# Altium project Carrier-Board-Apalis.PrjPcb (part 1 of 2)
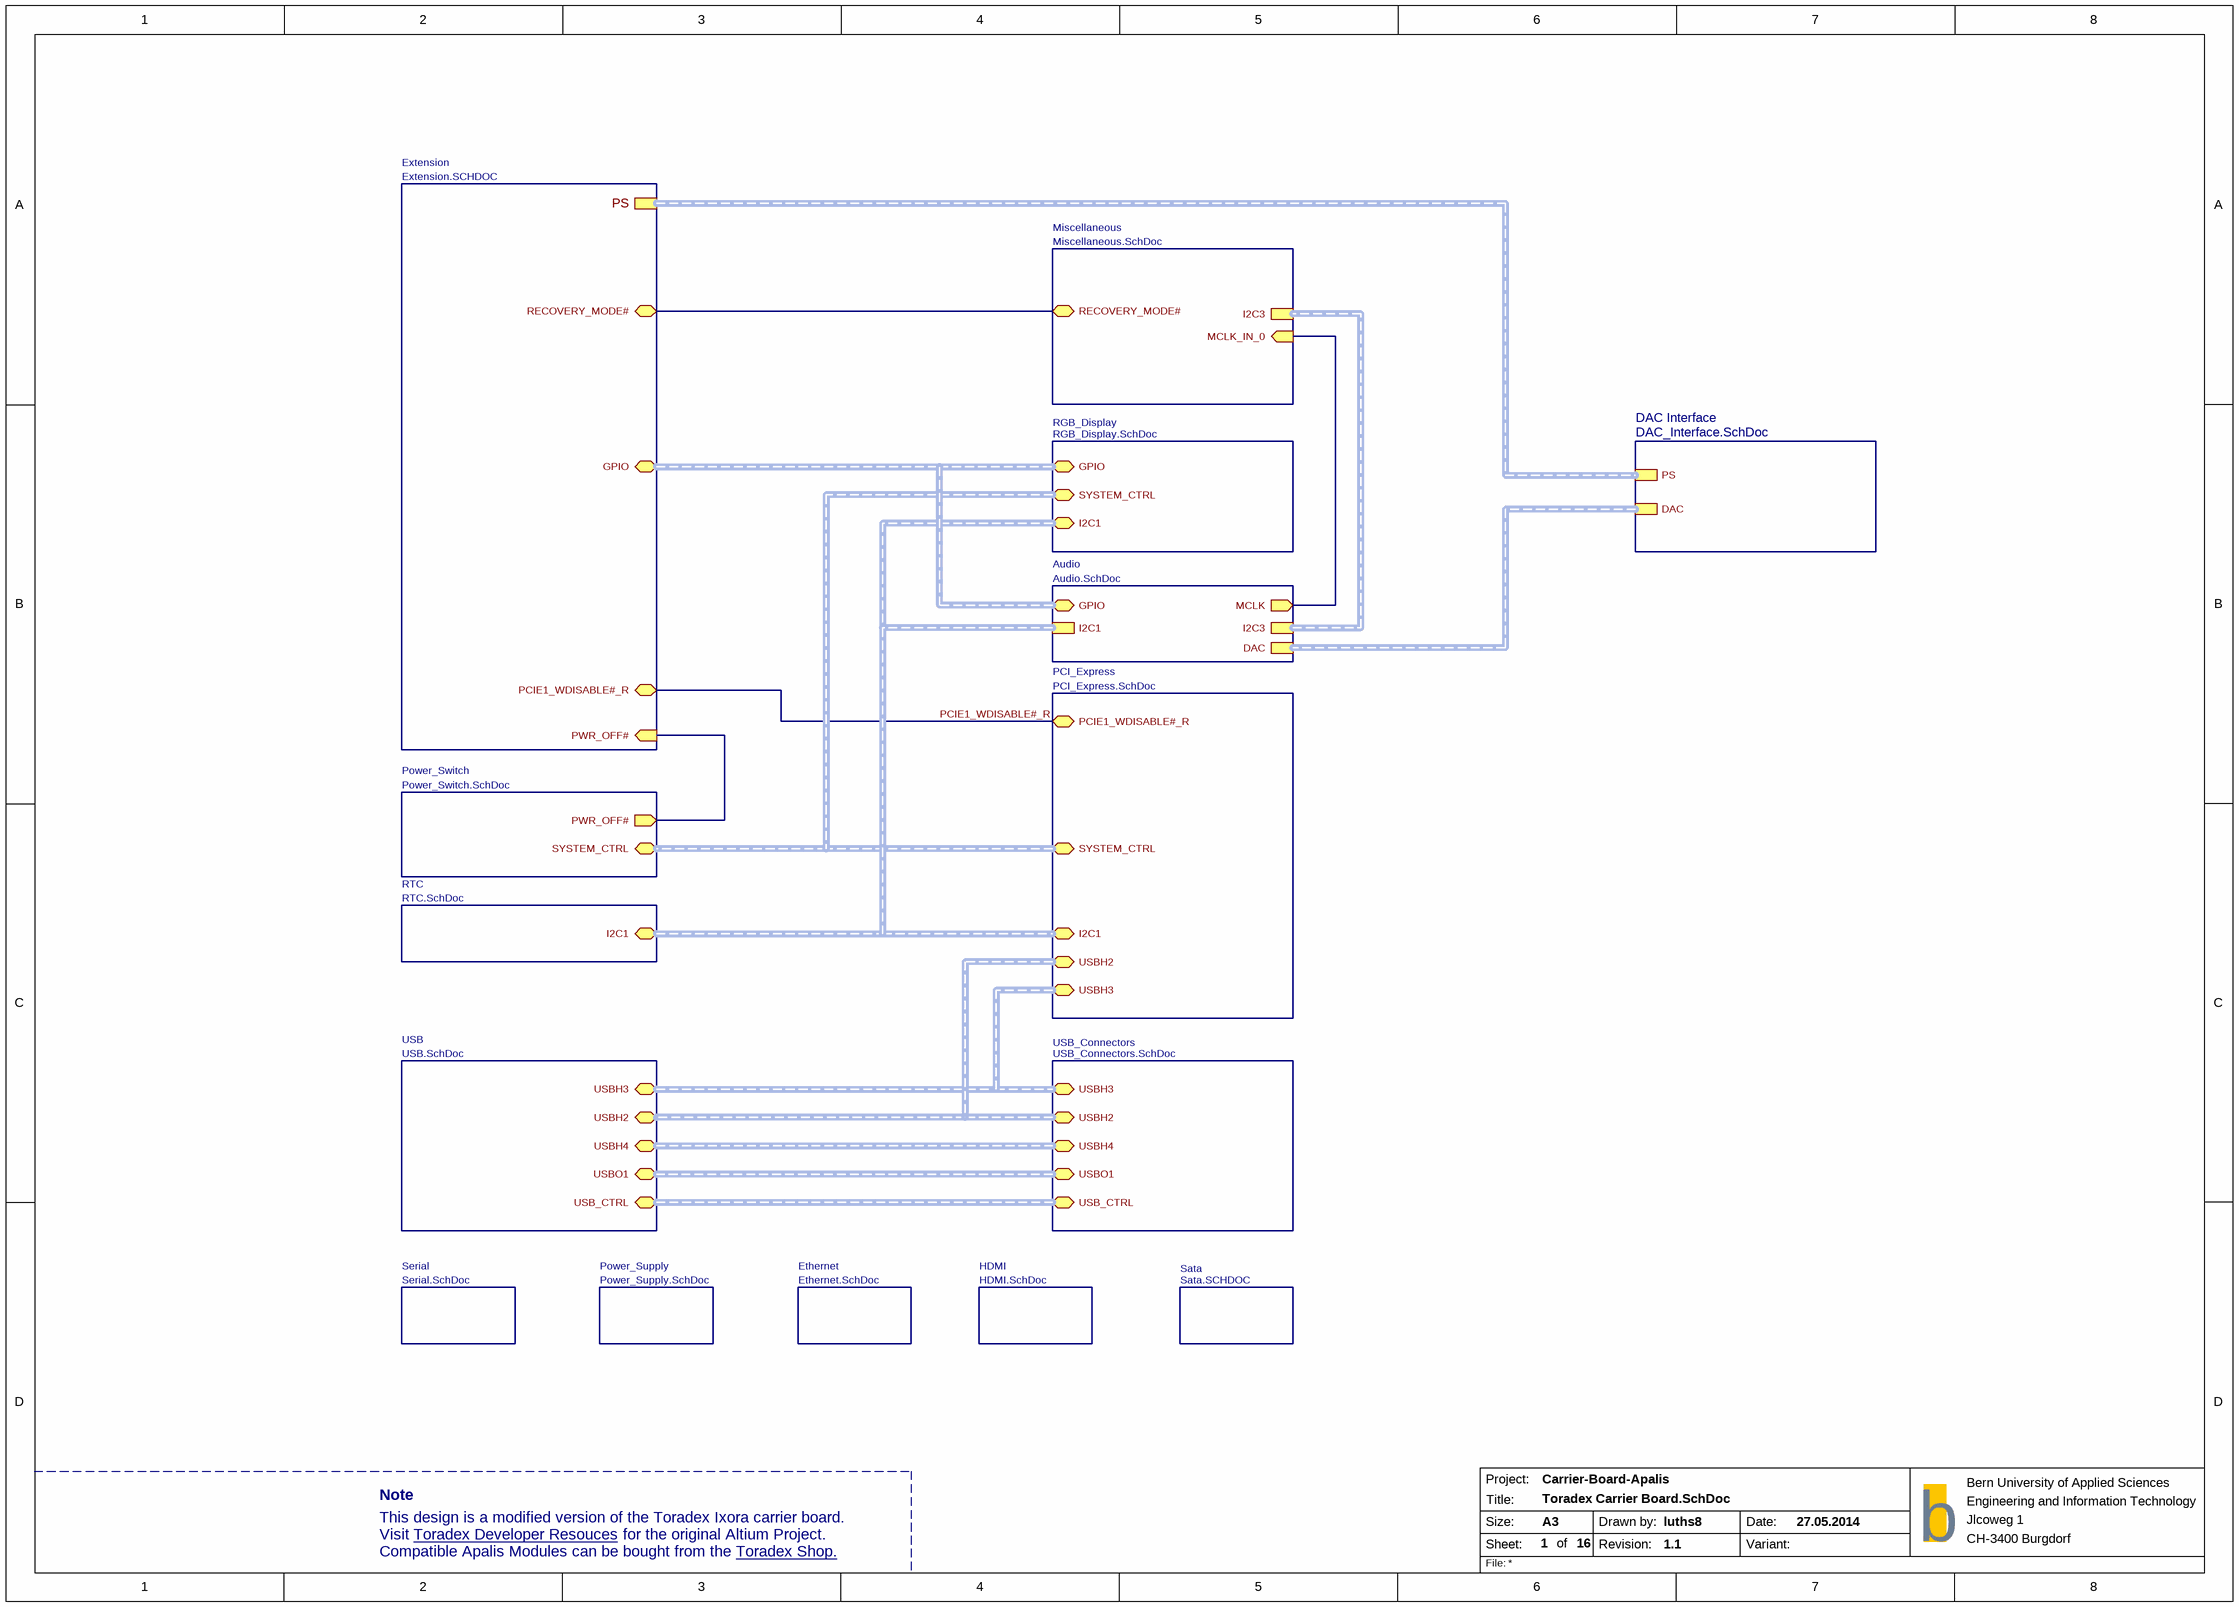
[diagram p0: Toradex Carrier Board.SchDoc]
ProjectAuthors: Klossner, Lüthi; ProjectName: Carrier-Board-Apalis; Revision: 1.1
16 sheets, 333 parts. Net scope: hierarchical (ports join the sheet entries above them; power ports are global).
Board file: Carrier-Board-Apalis.PcbDoc
Sheets:
  Toradex Carrier Board.SchDoc
    Ethernet = Ethernet.SchDoc
    PCI_Express = PCI_Express.SchDoc
    Power_Supply = Power_Supply.SchDoc
    Power_Switch = Power_Switch.SchDoc
    RGB_Display = RGB_Display.SchDoc
    RTC = RTC.SchDoc
    Sata = Sata.SchDoc
    Serial = Serial.SchDoc
    Extension = Extension.SchDoc
    USB_Connectors = USB_Connectors.SchDoc
    USB = USB.SchDoc
    HDMI = HDMI.SchDoc
    Miscellaneous = Miscellaneous.SchDoc
    Audio = Audio.SchDoc
    DAC Interface = DAC_Interface.SchDoc

## Sheet Toradex Carrier Board.SchDoc
size A3; PageSetup: Record=PageOptions|CenterHorizontal=True|CenterVertical=True|PrintScale=0.71|XCorrection=1.00|YCorrection=1.00|PrintKind=0|BorderSize=5000000|LeftOffset=0|BottomOffset=0|Orientation=2|PaperLength=1000|PaperWidth=1000|Scale=100|PaperSource=7|PrintQuality=600|MediaType=1|DitherType=10|PaperKind=A4|PrintScaleMode=1; Date: 27.05.2014; DrawnBy: luths8; Organization: BFH; Address1: Bern University of Applied Sciences; Address2: Engineering and Information Technology; Address3: Jlcoweg 1; Address4: CH-3400 Burgdorf; DocumentNumber: 1; Revision: 1.1; SheetNumber: 1; SheetTotal: 16; CurrentDate: 27.05.2014

### Sub-sheets
Audio = Audio.SchDoc: DAC (harness DAC), MCLK (out), I2C3 (harness I2C), I2C1 (harness I2C), GPIO (bidir, harness GPIO)
DAC Interface = DAC_Interface.SchDoc: PS (harness PS), DAC (harness DAC)
Ethernet = Ethernet.SchDoc: no entries
Extension = Extension.SCHDOC: GPIO (bidir, harness GPIO), RECOVERY_MODE# (bidir), PCIE1_WDISABLE#_R (bidir), PS (harness PS), PWR_OFF# (in)
HDMI = HDMI.SchDoc: no entries
Miscellaneous = Miscellaneous.SchDoc: RECOVERY_MODE# (bidir), MCLK_IN_0 (in), I2C3 (harness I2C)
PCI_Express = PCI_Express.SchDoc: I2C1 (bidir, harness I2C), USBH2 (bidir), SYSTEM_CTRL (bidir, harness SYS_CTRL), PCIE1_WDISABLE#_R (bidir), USBH3 (bidir)
Power_Supply = Power_Supply.SchDoc: no entries
Power_Switch = Power_Switch.SchDoc: SYSTEM_CTRL (bidir, harness SYS_CTRL), PWR_OFF# (out)
RGB_Display = RGB_Display.SchDoc: SYSTEM_CTRL (bidir, harness SYS_CTRL), GPIO (bidir, harness GPIO), I2C1 (bidir, harness I2C)
RTC = RTC.SchDoc: I2C1 (bidir, harness I2C)
Sata = Sata.SCHDOC: no entries
Serial = Serial.SchDoc: no entries
USB = USB.SchDoc: USBH2 (bidir, harness USB), USBO1 (bidir, harness USB_SS), USBH4 (bidir, harness USB_SS), USBH3 (bidir, harness USB), USB_CTRL (bidir, harness USB_CTRL)
USB_Connectors = USB_Connectors.SchDoc: USBO1 (bidir), USBH4 (bidir), USBH3 (bidir), USB_CTRL (bidir, harness USB_CTRL), USBH2 (bidir)

### Nets
INT#: sheet Power_Switch/PWR_OFF#, sheet Extension/PWR_OFF#
MXM3_191_M: sheet Miscellaneous/MCLK_IN_0, sheet Audio/MCLK
PCIE1_WDISABLE#_R: sheet PCI_Express/PCIE1_WDISABLE#_R, sheet Extension/PCIE1_WDISABLE#_R
RECOVERY_MODE#: sheet Extension/RECOVERY_MODE#, sheet Miscellaneous/RECOVERY_MODE#

### Buses and harness runs
harness sheet Audio/DAC = sheet DAC Interface/DAC
harness sheet Audio/GPIO = sheet Extension/GPIO = sheet RGB_Display/GPIO
harness sheet Audio/I2C1 = sheet PCI_Express/I2C1 = sheet RGB_Display/I2C1 = sheet RTC/I2C1
harness sheet Audio/I2C3 = sheet Miscellaneous/I2C3
harness sheet DAC Interface/PS = sheet Extension/PS
harness sheet PCI_Express/SYSTEM_CTRL = sheet Power_Switch/SYSTEM_CTRL = sheet RGB_Display/SYSTEM_CTRL
harness sheet PCI_Express/USBH2 = sheet USB/USBH2 = sheet USB_Connectors/USBH2
harness sheet PCI_Express/USBH3 = sheet USB/USBH3 = sheet USB_Connectors/USBH3
harness sheet USB/USB_CTRL = sheet USB_Connectors/USB_CTRL
harness sheet USB/USBH4 = sheet USB_Connectors/USBH4
harness sheet USB/USBO1 = sheet USB_Connectors/USBO1

### Notes on the sheet
- Note
- This design is a modified version of the Toradex Ixora carrier board.
- Visit
- Compatible Apalis Modules can be bought from the
- Toradex Developer Resouces <https://developer.toradex.com/products/ixora-carrier-board>
- for the original Altium Project.
- Toradex Shop. <https://www.toradex.com/order-now/apalis-arm-family>
- Project:
- Size:
- Sheet:
- Title:
- A3
- of
- Drawn by:
- Revision:
- Date:
- Variant:
- b
- File:

## Sheet Ethernet.SchDoc
size A3; PageSetup: Record=PageOptions|CenterHorizontal=True|CenterVertical=True|PrintScale=0.73|XCorrection=1.00|YCorrection=1.00|PrintKind=0|BorderSize=5000000|LeftOffset=0|BottomOffset=0|Orientation=2|PaperLength=1000|PaperWidth=1000|Scale=100|PaperSource=7|PrintQuality=-4|MediaType=1|DitherType=10|PaperKind=A4|PrintScaleMode=1; Date: 27.05.2014; DrawnBy: luths8; Organization: BFH; Address1: Bern University of Applied Sciences; Address2: Engineering and Information Technology; Address3: Jlcoweg 1; Address4: CH-3400 Burgdorf; DocumentNumber: 7; Revision: 1.0; SheetNumber: 7; SheetTotal: 16; CurrentDate: 27.05.2014
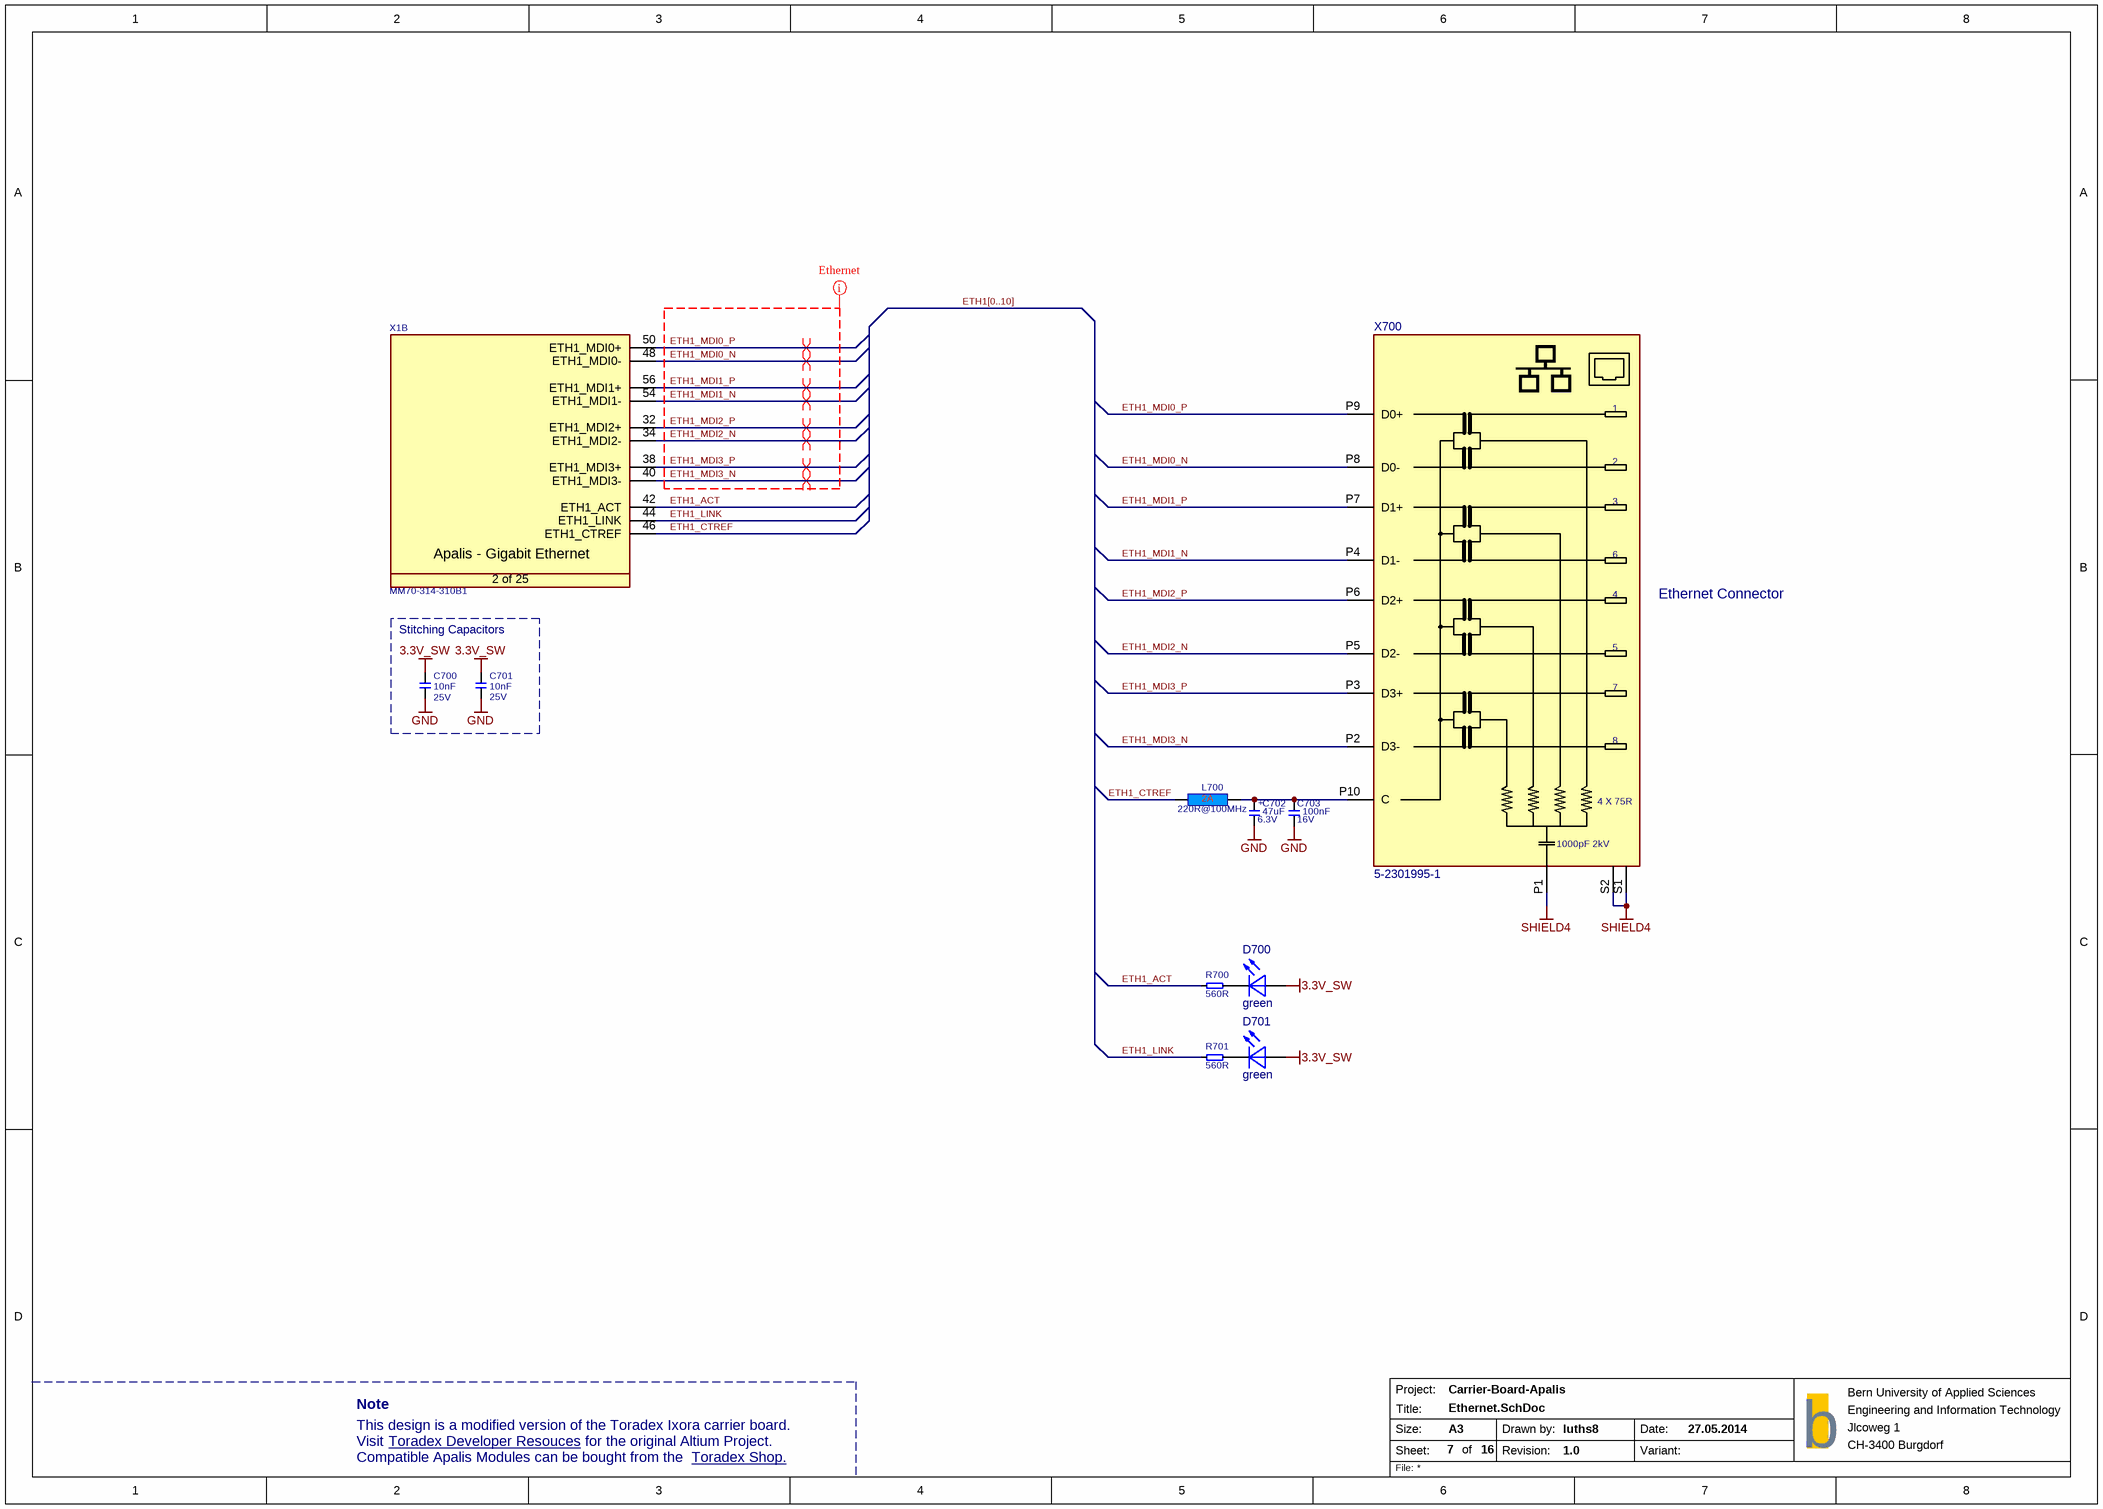
[diagram p1: Ethernet.SchDoc]

### Parts
C700  10nF  Rating: 25V  [SMD0603CAP]
C701  10nF  Rating: 25V  [SMD0603CAP]
C702  Rating: 6.3V  [T_CAPMP3216X180N]  (hidden comment: 47uF)
C703  Rating: 16V  [SMD0603CAP]  (hidden comment: 100nF)
D700  green  [LED]
D701  green  [LED]
L700  220R@100MHz  [INDC1608X95N]
R700  560R  [SMD0603RES]
R701  560R  [SMD0603RES]
X1  Manufacturer Part No.: MM70-314-310B1  [T_JAE_MM70-314-310B1]  (hidden comment: CON-JAE-MM70-314-310B1-314-0.5mm)  (part B of 25)
X700  5-2301995-1  [5-2301995-4]

### Blocks framed on the sheet
Stitching Capacitors: C700 C701

### Nets
3.3V_SW: C700.2 C701.2 D700.A D701.A
GND: C700.1 C701.1 C702.2 C703.1
SHIELD4: X700.P1(S) X700.S1(S) X700.S2(S)
ETH1_ACT: R700.1 X1.42(ETH1_ACT)
ETH1_CTREF: L700.1 X1.46(ETH1_CTREF)
ETH1_LINK: R701.1 X1.44(ETH1_LINK)
ETH1_MDI0_N: X1.48(ETH1_MDI0-) X700.P8(D0-)
ETH1_MDI0_P: X1.50(ETH1_MDI0+) X700.P9(D0+)
ETH1_MDI1_N: X1.54(ETH1_MDI1-) X700.P4(D1-)
ETH1_MDI1_P: X1.56(ETH1_MDI1+) X700.P7(D1+)
ETH1_MDI2_N: X1.34(ETH1_MDI2-) X700.P5(D2-)
ETH1_MDI2_P: X1.32(ETH1_MDI2+) X700.P6(D2+)
ETH1_MDI3_N: X1.40(ETH1_MDI3-) X700.P2(D3-)
ETH1_MDI3_P: X1.38(ETH1_MDI3+) X700.P3(D3+)
NetC702_1: C702.1 C703.2 L700.2 X700.P10(C)
NetD700_C: D700.C R700.2
NetD701_C: D701.C R701.2

### Buses and harness runs
bus ETH1[0..10]

### Layout directives
differential pair: ETH1_MDI0_N, ETH1_MDI0_P, ETH1_MDI1_N, ETH1_MDI1_P, ETH1_MDI2_N, ETH1_MDI2_P, ETH1_MDI3_N, ETH1_MDI3_P
net class Ethernet: ETH1_MDI0_N, ETH1_MDI0_P, ETH1_MDI1_N, ETH1_MDI1_P, ETH1_MDI2_N, ETH1_MDI2_P, ETH1_MDI3_N, ETH1_MDI3_P

### Notes on the sheet
- (near X700) Ethernet Connector
- Note
- This design is a modified version of the Toradex Ixora carrier board.
- Visit
- Compatible Apalis Modules can be bought from the
- Toradex Developer Resouces <https://developer.toradex.com/products/ixora-carrier-board>
- for the original Altium Project.
- Toradex Shop. <https://www.toradex.com/order-now/apalis-arm-family>
- Project:
- Size:
- Sheet:
- Title:
- A3
- of
- Drawn by:
- Revision:
- Date:
- Variant:
- b
- File:
- (in symbol C-TA-47uF-6.3V-20%-3216) +
- (in symbol CON-JAE-MM70-314-310B1-314-0.5mm, part B) Apalis - Gigabit Ethernet; 2 of 25
- (in symbol CON-TE-5-2301995-1) 1; 2; 3; 6; 4; 5; 7; 8; 4 X 75R; 1000pF 2kV

### Library data of the parts
C700 C701 = C-X7R-10nF-25V-10%-0603: Capacitor Ceramic X7R 10nF 25V 10% 0603; Tolerance: 10%; Type: X7R; Value: 10nF
C702 = C-TA-47uF-6.3V-20%-3216: Capacitor TA 47uF 6.3V 20% 3216; Tolerance: 20%; Type: TA; Value: 47uF
C703 = C-X7R-100nF-16V-10%-0402: Capacitor Ceramic X7R 100nF 16V 10% 0603; Tolerance: 10%; Type: X7R; Value: 100nF
D700 D701 = LED green: Manufacturer Part No.: LGM67KG1J224Z
L700 = L-220R@100MHz-2A-25%-0603: 220R@100MHz 2A EMI FILTER; Tolerance: 25%; Rating: 2A; Value: 220R@100MHz
R700 R701 = R-560R-63mW-5%-0402: Resistor 560 ohm 63mW 5% 0603; Rating: 63mW; Tolerance: 5%; Value: 560R
X1 = CON-JAE-MM70-314-310B1-314-0.5mm: MXM3 Connector; Manufacturer Name: JAE; No. of ways: 314
X700 = CON-TE-5-2301995-1: Vertical 10/100/1G Mag Jack; Manufacturer Part No.: 5-2301995-1

## Sheet PCI_Express.SchDoc
size A3; PageSetup: Record=PageOptions|CenterHorizontal=True|CenterVertical=True|PrintScale=0.73|XCorrection=1.00|YCorrection=1.00|PrintKind=0|BorderSize=5000000|LeftOffset=0|BottomOffset=0|Orientation=2|PaperLength=1000|PaperWidth=1000|Scale=100|PaperSource=7|PrintQuality=-4|MediaType=1|DitherType=10|PaperKind=A4|PrintScaleMode=1; Date: 27.05.2014; DrawnBy: luths8; Organization: BFH; Address1: Bern University of Applied Sciences; Address2: Engineering and Information Technology; Address3: Jlcoweg 1; Address4: CH-3400 Burgdorf; DocumentNumber: 13; Revision: 1.0; SheetNumber: 13; SheetTotal: 16; CurrentDate: 27.05.2014
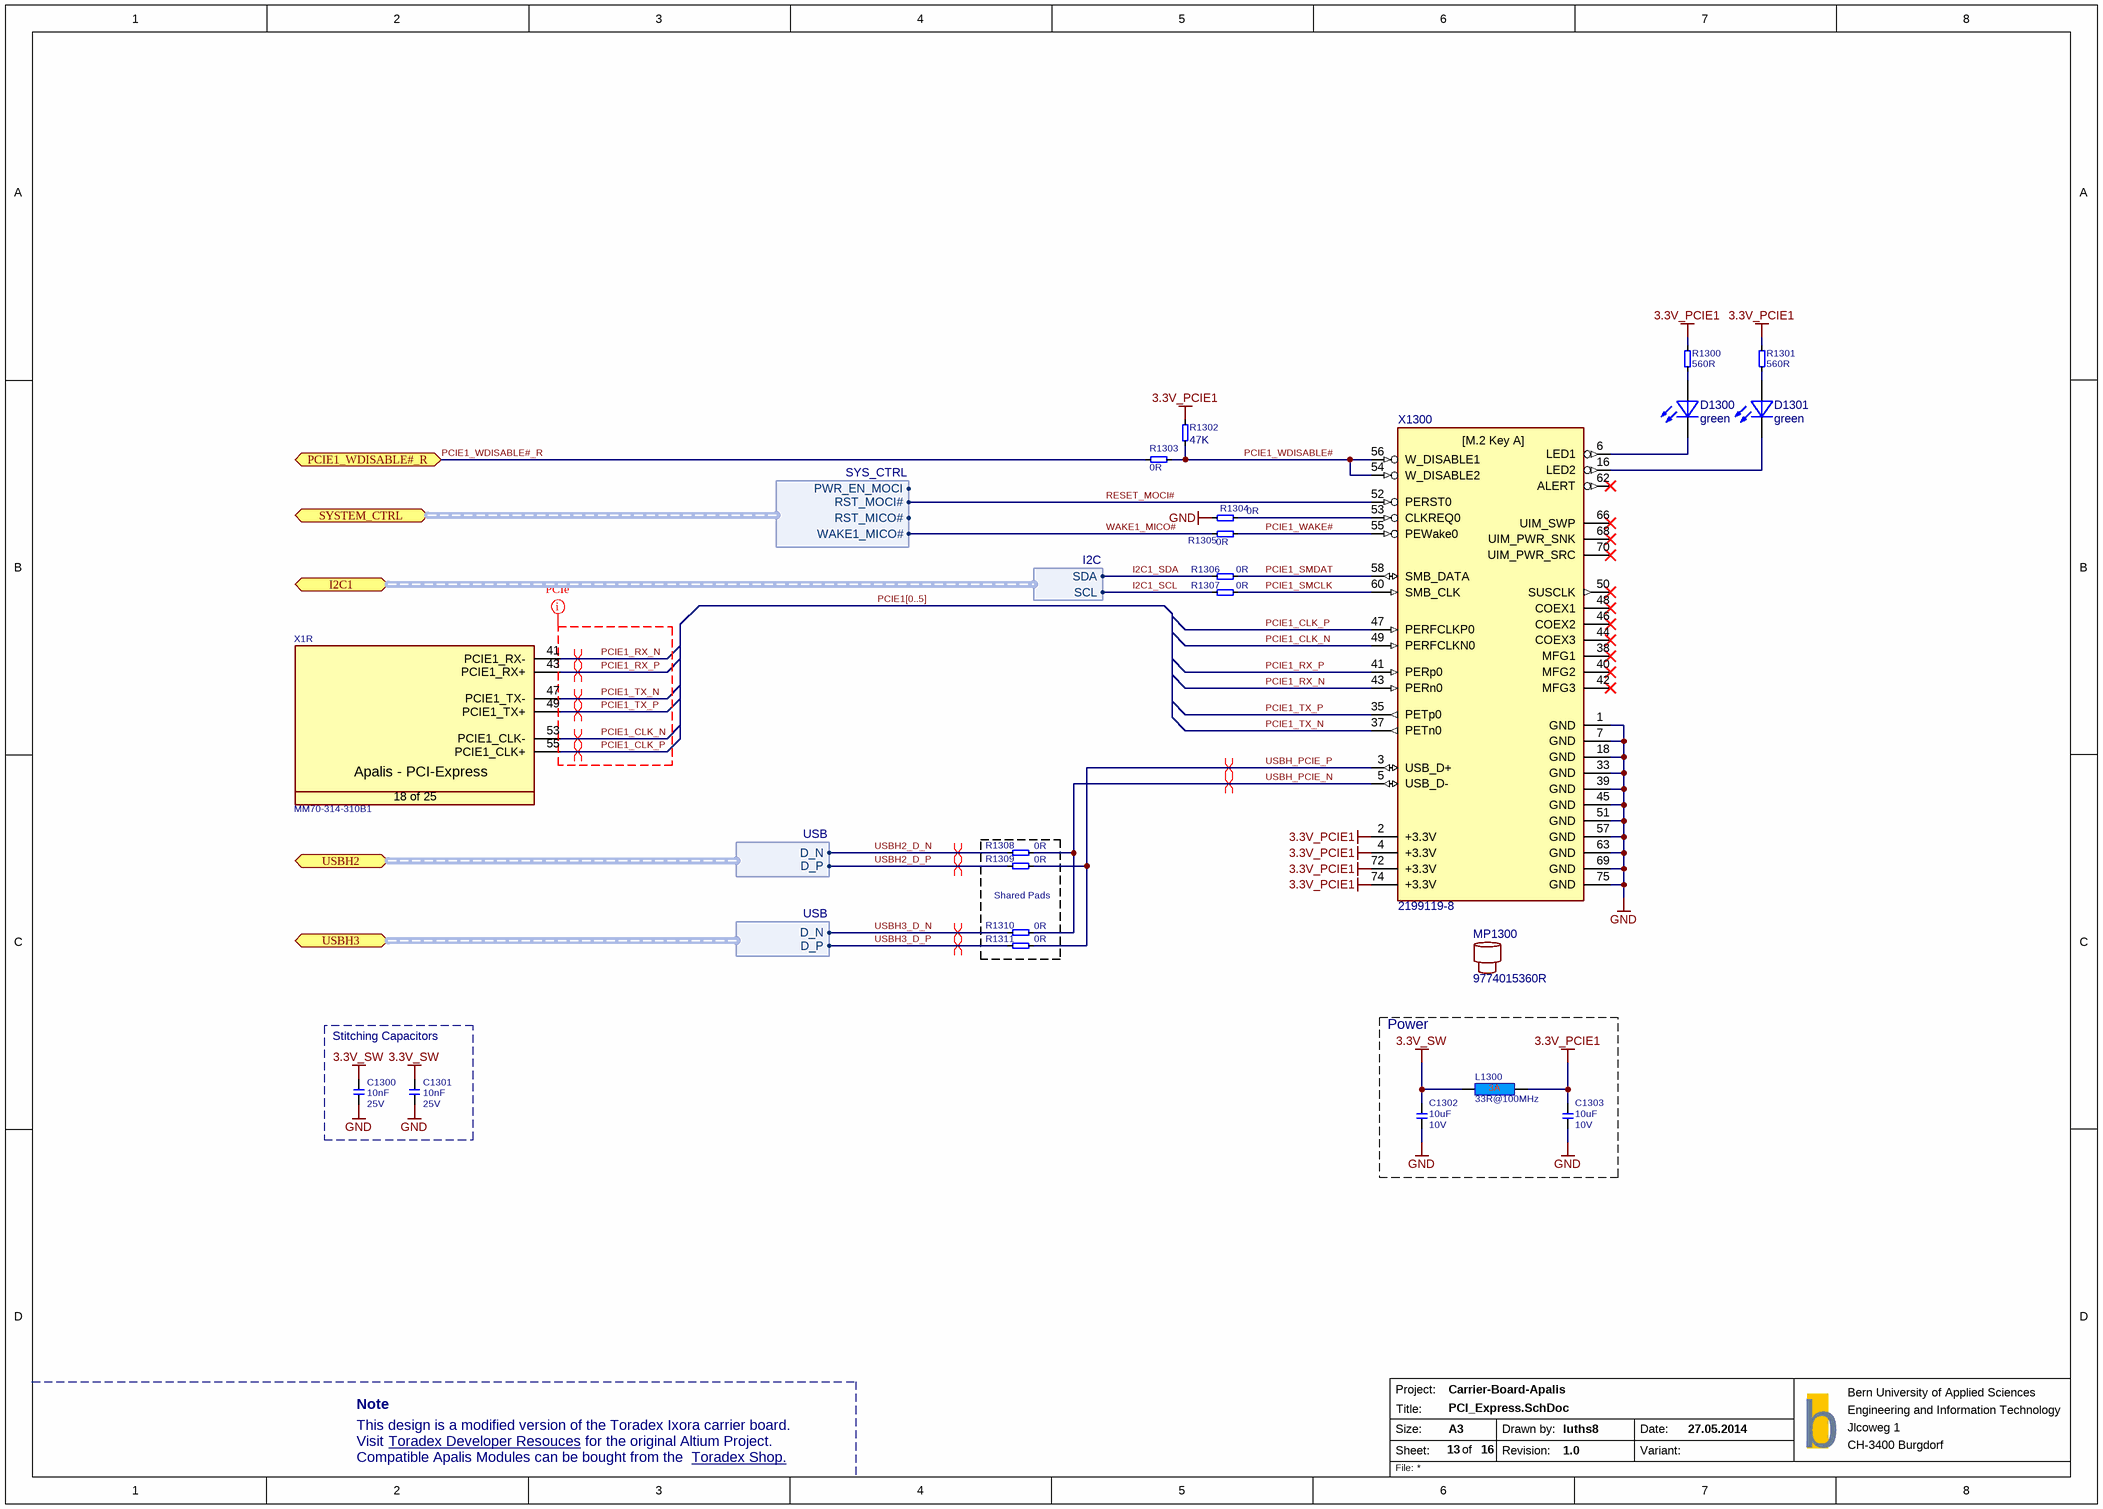
[diagram p2: PCI_Express.SchDoc]

### Parts
C1300  10nF  Rating: 25V  [SMD0603CAP]
C1301  10nF  Rating: 25V  [SMD0603CAP]
C1302  Rating: 10V  [SMD0603CAP]  (hidden comment: 10uF)
C1303  Rating: 10V  [SMD0603CAP]  (hidden comment: 10uF)
D1300  green  [LED]
D1301  green  [LED]
L1300  33R@100MHz  [INDC1608X95N]
MP1300  9774015360R
R1300  560R  [SMD0603RES]
R1301  560R  [SMD0603RES]
R1302  47K  [SMD0603RES]
R1303  0R  [SMD0603RES]
R1304  0R  [SMD0603RES]
R1305  0R  [SMD0603RES]
R1306  0R  [SMD0603RES]
R1307  0R  [SMD0603RES]
R1308  0R  [SMD0603RES]
R1309  0R  [SMD0603RES]
R1310  0R  [SMD0603RES]
R1311  0R  [SMD0603RES]
X1  Manufacturer Part No.: MM70-314-310B1  [T_JAE_MM70-314-310B1]  (hidden comment: CON-JAE-MM70-314-310B1-314-0.5mm)  (part R of 25)
X1300  2199119-8  [2199119-8-KEY-A-2230]

### Blocks framed on the sheet
Shared Pads: R1308-R1311
Stitching Capacitors: C1300 C1301
Power: C1302 C1303 L1300

### Ports
I2C1 (bidir, harness I2C, see 12, 17, 19, 5), PCIE1_WDISABLE#_R (bidir, see 19), SYSTEM_CTRL (bidir, harness SYS_CTRL, see 12, 19, 4), USBH2 (bidir, harness USB, see 6, 7), USBH3 (bidir, harness USB, see 6, 7)

### Harnesses
USB: D_N, D_P
I2C: SCL, SDA
SYS_CTRL: PWR_EN_MOCI, RST_MOCI#, RST_MICO#, WAKE1_MICO#

### Nets
3.3V_PCIE1: C1303.2 L1300.2 R1300.1 R1301.1 R1302.2 X1300.2(+3.3V) X1300.4(+3.3V) X1300.72(+3.3V) X1300.74(+3.3V)
3.3V_SW: C1300.2 C1301.2 C1302.2 L1300.1
GND: C1300.1 C1301.1 C1302.1 C1303.1 R1304.1 X1300.1(GND) X1300.7(GND) X1300.18(GND) X1300.33(GND) X1300.39(GND) X1300.45(GND) X1300.51(GND) X1300.57(GND) X1300.63(GND) X1300.69(GND) X1300.75(GND)
I2C1_SCL: R1307.1 ; port I2C1.SCL
I2C1_SDA: R1306.1 ; port I2C1.SDA
PCIE1_CLK_N: X1.53(PCIE1_CLK-) X1300.49(PERFCLKN0)
PCIE1_CLK_P: X1.55(PCIE1_CLK+) X1300.47(PERFCLKP0)
PCIE1_RX_N: X1.41(PCIE1_RX-) X1300.43(PERn0)
PCIE1_RX_P: X1.43(PCIE1_RX+) X1300.41(PERp0)
PCIE1_SMCLK: R1307.2 X1300.60(SMB_CLK)
PCIE1_SMDAT: R1306.2 X1300.58(SMB_DATA)
PCIE1_TX_N: X1.47(PCIE1_TX-) X1300.37(PETn0)
PCIE1_TX_P: X1.49(PCIE1_TX+) X1300.35(PETp0)
PCIE1_WAKE#: R1305.2 X1300.55(PEWake0)
PCIE1_WDISABLE#: R1302.1 R1303.1 X1300.54(W_DISABLE2) X1300.56(W_DISABLE1)
PCIE1_WDISABLE#_R: R1303.2 ; port PCIE1_WDISABLE#_R
RESET_MOCI#: X1300.52(PERST0) ; port SYSTEM_CTRL.RST_MOCI#
USBH2_D_N: R1308.1 ; port USBH2.D_N
USBH2_D_P: R1309.1 ; port USBH2.D_P
USBH3_D_N: R1310.1 ; port USBH3.D_N
USBH3_D_P: R1311.1 ; port USBH3.D_P
USBH_PCIE_N: R1308.2 R1310.2 X1300.5(USB_D-)
USBH_PCIE_P: R1309.2 R1311.2 X1300.3(USB_D+)
WAKE1_MICO#: R1305.1 ; port SYSTEM_CTRL.WAKE1_MICO#
NetD1300_A: D1300.A R1300.2
NetD1300_C: D1300.C X1300.6(LED1)
NetD1301_A: D1301.A R1301.2
NetD1301_C: D1301.C X1300.16(LED2)
NetR1304_2: R1304.2 X1300.53(CLKREQ0)

Not connected (* = marked no-connect by the designer): X1300 38(MFG1)* 40(MFG2)* 42(MFG3)* 44(COEX3)* 46(COEX2)* 48(COEX1)* 50(SUSCLK)* 62(ALERT)* 66(UIM_SWP)* 68(UIM_PWR_SNK)* 70(UIM_PWR_SRC)*

### Buses and harness runs
bus PCIE1[0..5]

### Layout directives
differential pair: PCIE1_CLK_N, PCIE1_CLK_P, PCIE1_RX_N, PCIE1_RX_P, PCIE1_TX_N, PCIE1_TX_P, USBH2_D_N, USBH2_D_P, USBH3_D_N, USBH3_D_P, USBH_PCIE_N, USBH_PCIE_P
net class PCIe: PCIE1_CLK_N, PCIE1_CLK_P, PCIE1_RX_N, PCIE1_RX_P, PCIE1_TX_N, PCIE1_TX_P

### Notes on the sheet
- Note
- This design is a modified version of the Toradex Ixora carrier board.
- Visit
- Compatible Apalis Modules can be bought from the
- Toradex Developer Resouces <https://developer.toradex.com/products/ixora-carrier-board>
- for the original Altium Project.
- Toradex Shop. <https://www.toradex.com/order-now/apalis-arm-family>
- Project:
- Size:
- Sheet:
- Title:
- A3
- of
- Drawn by:
- Revision:
- Date:
- Variant:
- b
- File:
- (in symbol CON-JAE-MM70-314-310B1-314-0.5mm, part R) Apalis - PCI-Express; 18 of 25
- (in symbol Connector M.2 Key A) [M.2 Key A]

### Library data of the parts
C1300 C1301 = C-X7R-10nF-25V-10%-0603: Capacitor Ceramic X7R 10nF 25V 10% 0603; Tolerance: 10%; Type: X7R; Value: 10nF
C1302 C1303 = C-X5R-10uF-10V-20%-0603: Capacitor Ceramic X5R 10uF 10V 20% 0603; Tolerance: 20%; Type: X5R; Value: 10uF
D1300 D1301 = LED green: Manufacturer Part No.: LGM67KG1J224Z
L1300 = L-33R@100MHz-3A-25%-0603: 33R@100MHz 3A EMI FILTER; Tolerance: 25%; Rating: 3A; Value: 33R@100MHz
MP1300 = Spacer M3 SMD: Manufacturer Part No.: 9774015360R
R1300 R1301 = R-560R-63mW-5%-0402: Resistor 560 ohm 63mW 5% 0603; Rating: 63mW; Tolerance: 5%; Value: 560R
R1302 = R-47KR-63mW-5%-0603: Resistor 47 Kohm 63mW 5% 0603; Value: 47KR; Rating: 63mW; Tolerance: 5%
R1303-R1305 R1308-R1311 = R-0R-63mW-1%-0603: Resistor 0 ohm 63mW 1% 0603; Rating: 63mW; Tolerance: 1%; Value: 0R
R1306 R1307 = R-0R-63mW-1%-0402: Resistor 0 ohm 63mW 1% 0603; Rating: 63mW; Tolerance: 1%; Value: 0R
X1 = CON-JAE-MM70-314-310B1-314-0.5mm: as X1 on sheet Ethernet
X1300 = Connector M.2 Key A: Manufacturer Part No.: 2199119-8

## Sheet Power_Supply.SchDoc
size A3; PageSetup: Record=PageOptions|CenterHorizontal=True|CenterVertical=True|PrintScale=0.73|XCorrection=1.00|YCorrection=1.00|PrintKind=0|BorderSize=5000000|LeftOffset=0|BottomOffset=0|Orientation=2|PaperLength=1000|PaperWidth=1000|Scale=100|PaperSource=7|PrintQuality=-4|MediaType=1|DitherType=10|PaperKind=A4|PrintScaleMode=1; Date: 27.05.2014; DrawnBy: luths8; Organization: BFH; Address1: Bern University of Applied Sciences; Address2: Engineering and Information Technology; Address3: Jlcoweg 1; Address4: CH-3400 Burgdorf; DocumentNumber: 2; Revision: 1.0; SheetNumber: 2; SheetTotal: 16; CurrentDate: 27.05.2014
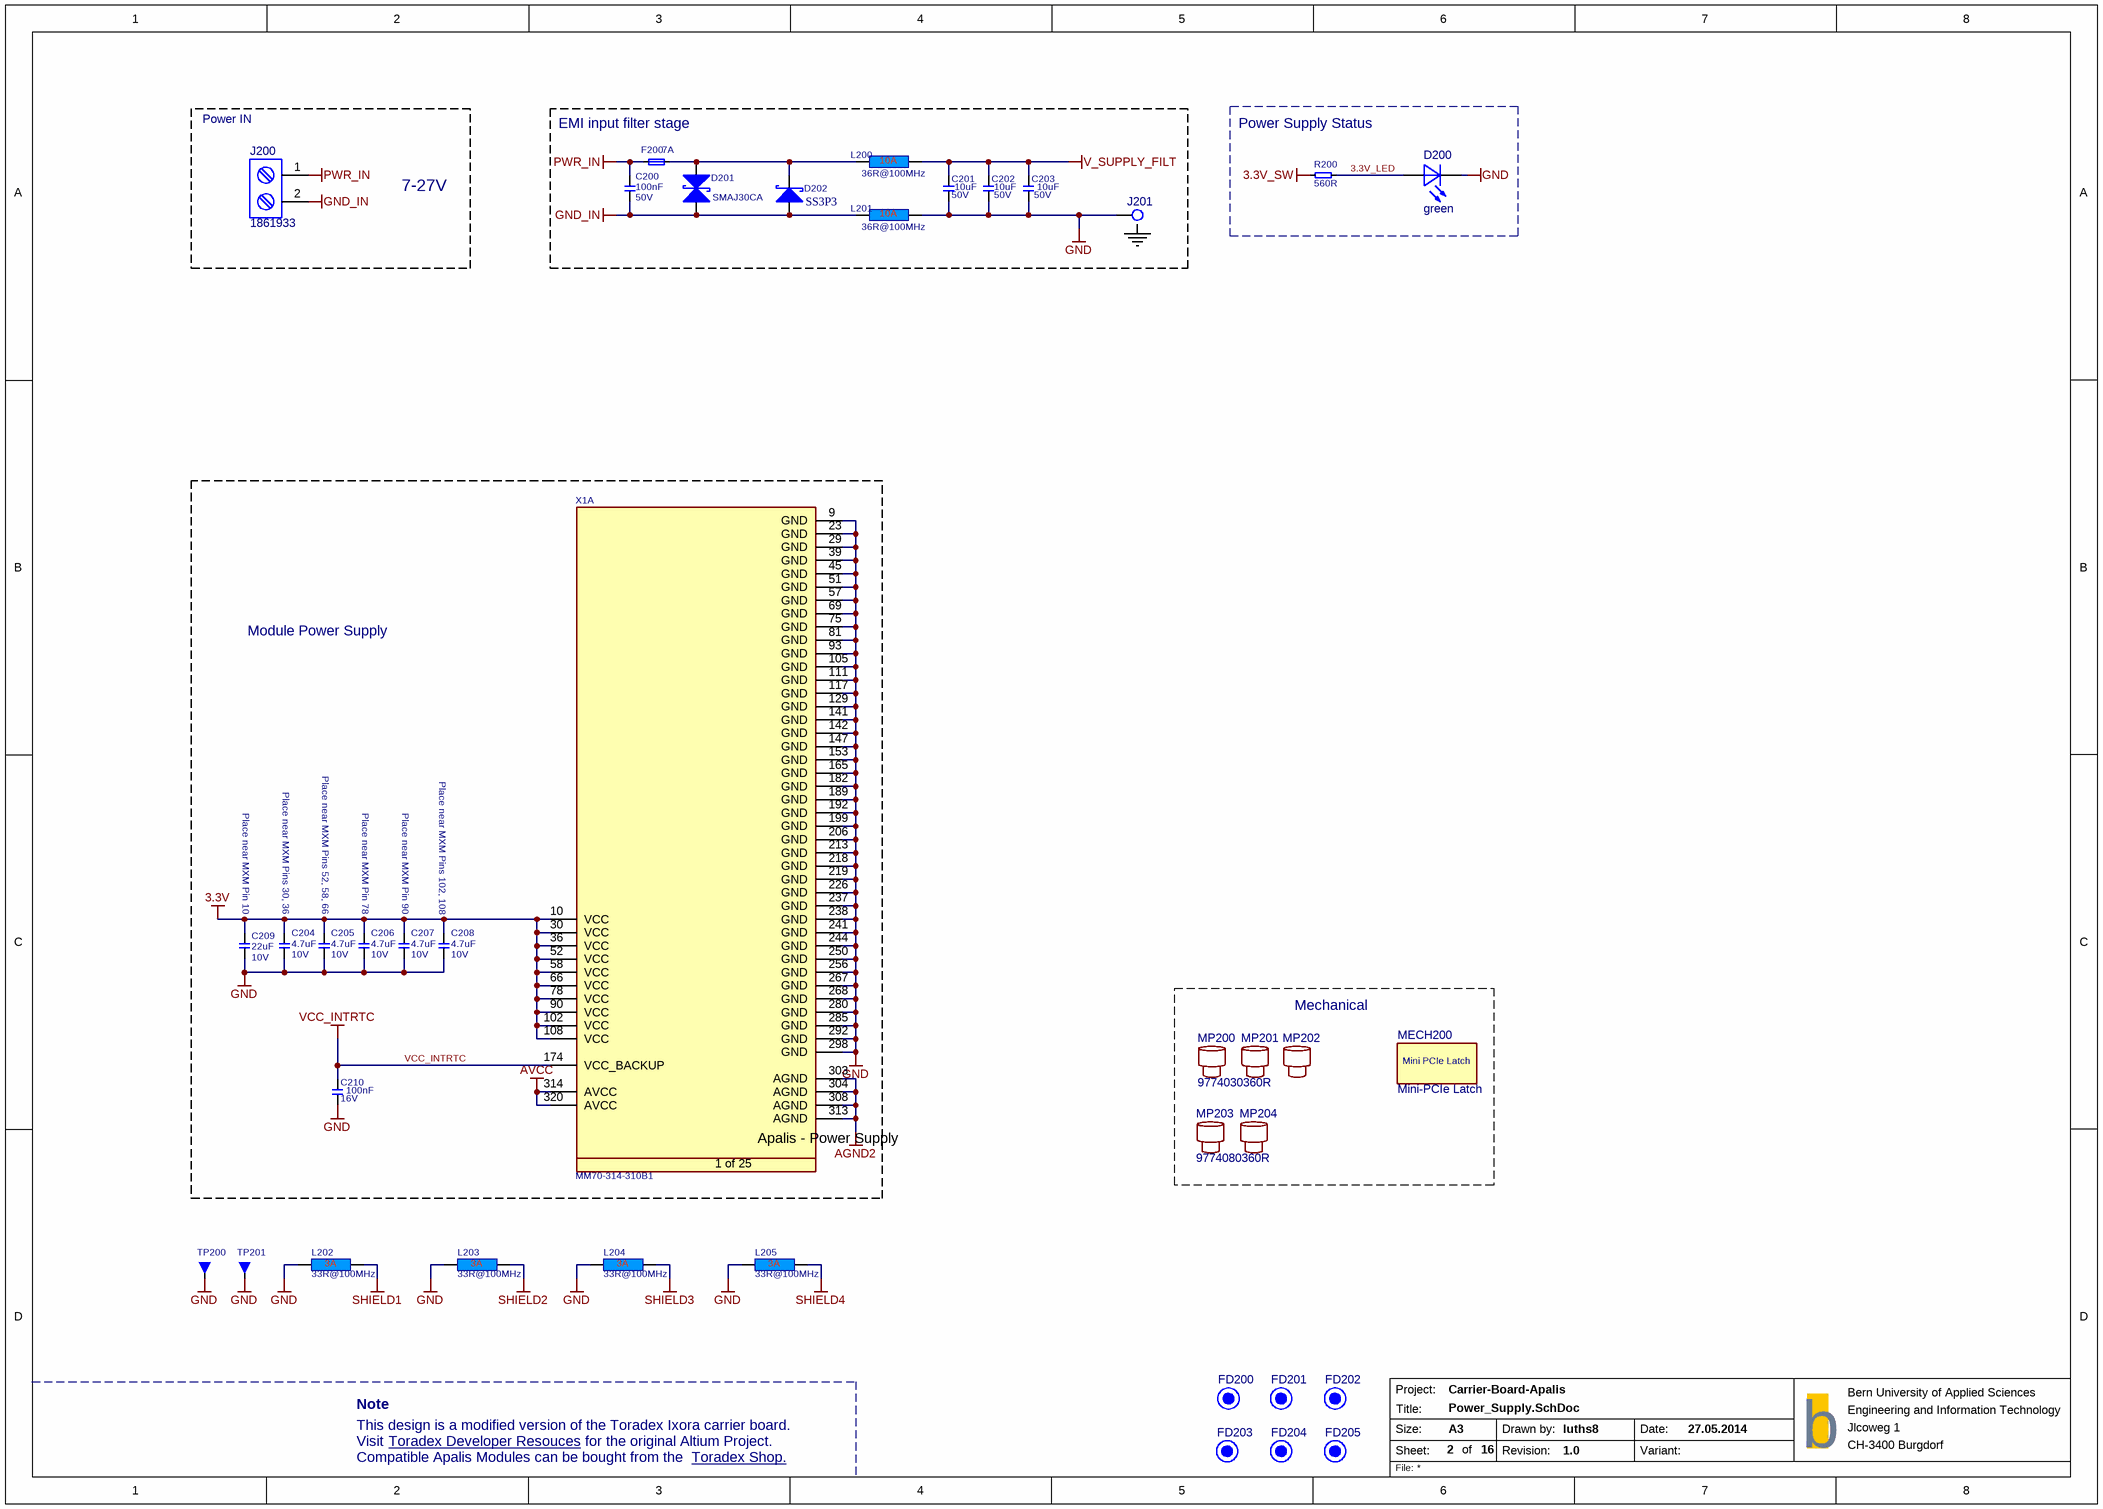
[diagram p3: Power_Supply.SchDoc]

### Parts
C200  Rating: 50V  [SMD0603CAP]  (hidden comment: 100nF)
C201  Rating: 50V  [SMD1210CAP]  (hidden comment: 10uF)
C202  Rating: 50V  [SMD1210CAP]  (hidden comment: 10uF)
C203  Rating: 50V  [SMD1210CAP]  (hidden comment: 10uF)
C204  Rating: 10V  [SMD0603CAP]  (hidden comment: 4.7uF)
C205  Rating: 10V  [SMD0603CAP]  (hidden comment: 4.7uF)
C206  Rating: 10V  [SMD0603CAP]  (hidden comment: 4.7uF)
C207  Rating: 10V  [SMD0603CAP]  (hidden comment: 4.7uF)
C208  Rating: 10V  [SMD0603CAP]  (hidden comment: 4.7uF)
C209  Rating: 10V  [SMD0805CAP]  (hidden comment: 22uF)
C210  Rating: 16V  [SMD0603CAP]  (hidden comment: 100nF)
D200  green  [LED]
D201  Manufacturer Part No.: SMAJ30CA  [T_LITTLEFUSE_SMAJ30CA]  (hidden comment: D-Littelfuse-SMAJ30CA-Schottky)
D202  SS3P3  [T_VISHAY_SS3P3]
F200  7A  [T_Littelfuse_0458]
FD200  Fiducial  [FIDUCIAL]  (value not drawn)  (no BOM)
FD201  Fiducial  [FIDUCIAL]  (value not drawn)  (no BOM)
FD202  Fiducial  [FIDUCIAL]  (value not drawn)  (no BOM)
FD203  Fiducial  [FIDUCIAL]  (value not drawn)  (no BOM)
FD204  Fiducial  [FIDUCIAL]  (value not drawn)  (no BOM)
FD205  Fiducial  [FIDUCIAL]  (value not drawn)  (no BOM)
J200  1861933  [1861933]
J201  Solder Pin  [SOLDER_PIN]  (value not drawn)  (net tie, no BOM)
L200  36R@100MHz  [T_Laird_35F0121-0SR-10]
L201  36R@100MHz  [T_Laird_35F0121-0SR-10]
L202  33R@100MHz  [INDC1608X95N]
L203  33R@100MHz  [INDC1608X95N]
L204  33R@100MHz  [INDC1608X95N]
L205  33R@100MHz  [INDC1608X95N]
MECH200  Mini-PCIe Latch  [T_Molex_48099-5701]
MP200  9774030360R
MP201  9774030360R  (value not drawn)
MP202  9774030360R  (value not drawn)
MP203  9774080360R
MP204  9774080360R  (value not drawn)
R200  560R  [SMD0603RES]
TP200  5011  [T_TP-THT - EYE]  (value not drawn)
TP201  5011  [T_TP-THT - EYE]  (value not drawn)
X1  Manufacturer Part No.: MM70-314-310B1  [T_JAE_MM70-314-310B1]  (hidden comment: CON-JAE-MM70-314-310B1-314-0.5mm)  (part A of 25)

### Blocks framed on the sheet
7-27V: J200
EMI input filter stage: C200-C203 D201 D202 F200 J201 L200 L201
Power Supply Status: D200 R200
Module Power Supply: C204-C210 X1
Mechanical: MECH200 MP200-MP204

### Nets
3.3V: C204.1 C205.1 C206.1 C207.1 C208.1 C209.1 X1.10(VCC) X1.30(VCC) X1.36(VCC) X1.52(VCC) X1.58(VCC) X1.66(VCC) X1.78(VCC) X1.90(VCC) X1.102(VCC) X1.108(VCC)
3.3V_SW: R200.1
AGND2: X1.303(AGND) X1.304(AGND) X1.308(AGND) X1.313(AGND)
AVCC: X1.314(AVCC) X1.320(AVCC)
GND: C201.1 C202.1 C203.1 C204.2 C205.2 C206.2 C207.2 C208.2 C209.2 C210.1 D200.C J201.1 L201.2 L202.1 L203.1 L204.1 L205.1 TP200.1 TP201.1 X1.9(GND) X1.23(GND) X1.29(GND) X1.39(GND) X1.45(GND) X1.51(GND) X1.57(GND) X1.69(GND) X1.75(GND) X1.81(GND) X1.93(GND) X1.105(GND) X1.111(GND) X1.117(GND) X1.129(GND) X1.141(GND) X1.142(GND) X1.147(GND) X1.153(GND) X1.165(GND) X1.182(GND) X1.189(GND) X1.192(GND) X1.199(GND) X1.206(GND) X1.213(GND) X1.218(GND) X1.219(GND) X1.226(GND) X1.237(GND) X1.238(GND) X1.241(GND) X1.244(GND) X1.250(GND) X1.256(GND) X1.267(GND) X1.268(GND) X1.280(GND) X1.285(GND) X1.292(GND) X1.298(GND)
GND_IN: C200.1 D201.2(Anode) D202.2 J200.2 L201.1
PWR_IN: C200.2 F200.1 J200.1
SHIELD1: L202.2
SHIELD2: L203.2
SHIELD3: L204.2
SHIELD4: L205.2
V_SUPPLY_FILT: C201.2 C202.2 C203.2 L200.2
VCC_INTRTC: C210.2 X1.174(VCC_BACKUP)
3.3V_LED: D200.A R200.2
NetD201_1: D201.1(Cathode) D202.1 F200.2 L200.1

### Notes on the sheet
- Power IN
- (near C204) Place near MXM Pins 30, 36
- (near C205) Place near MXM Pins 52, 58, 66
- Place near MXM Pins 102, 108
- Place near MXM Pin 10
- Place near MXM Pin 78
- Place near MXM Pin 90
- Note
- This design is a modified version of the Toradex Ixora carrier board.
- Visit
- Compatible Apalis Modules can be bought from the
- Toradex Developer Resouces <https://developer.toradex.com/products/ixora-carrier-board>
- for the original Altium Project.
- Toradex Shop. <https://www.toradex.com/order-now/apalis-arm-family>
- Project:
- Size:
- Sheet:
- Title:
- A3
- of
- Drawn by:
- Revision:
- Date:
- Variant:
- b
- File:
- (in symbol CON-JAE-MM70-314-310B1-314-0.5mm, part A) Apalis - Power Supply; 1 of 25
- (in symbol MECH-Molex-48099-5701) Mini PCIe Latch

### Library data of the parts
C200 = C-X7R-100nF-50V-20%-0603: Capacitor Ceramic X7R 100nF 50V 20% 0603; Tolerance: 20%; Type: X7R; Value: 100nF
C201-C203 = C-X5R-10uF-50V-20%-1210: Capacitor Ceramic X5R 10uF 50V 20% 1210; Tolerance: 20%; Type: X5R; Value: 10uF
C204-C208 = C-X5R-4.7uF-10V-10%-0603: Capacitor Ceramic X5R 4.7uF 10V 10% 0603; Tolerance: 10%; Type: X5R; Value: 4.7uF
C209 = C-X5R-22uF-10V-20%-0805: Capacitor Ceramic X5R 22uF 10V 20% 0805; Tolerance: 20%; Type: X5R; Value: 22uF
C210 = C-X7R-100nF-16V-10%-0402: Capacitor Ceramic X7R 100nF 16V 10% 0603; Tolerance: 10%; Type: X7R; Value: 100nF
D200 = LED green: Manufacturer Part No.: LGM67KG1J224Z
D201 = D-Littelfuse-SMAJ30CA-Schottky: Bidirectional ESD protection; Manufacturer Name: Littelfuse
D202 = D-Vishay-SS3P3-E3/84A-Schottky: SS3P3-E3/84A Schottky Diode; Manufacturer Name: Vishay; Manufacturer Part No.: SS3P3-E3/84A
F200 = F-Littelfuse-0458007: Fuse 7A Fast; Manufacturer Part No.: 0458007; Manufacturer Name: Littelfuse; Value: 7A
FD200-FD205 = Fiducial: Fiducial Marker
J200 = 1861933: Screw Terminal, 2 Position, 5mm Spacing; System: Connector
L200 L201 = L-Laird-35F0121-0SR-10-10A-25%: Power Supply FB 10A; Tolerance: 25%; Rating: 10A; Value: 36R@100MHz
L202-L205 = L-33R@100MHz-3A-25%-0603: 33R@100MHz 3A EMI FILTER; Tolerance: 25%; Rating: 3A; Value: 33R@100MHz
MECH200 = MECH-Molex-48099-5701: Manufacturer Name: Molex; Manufacturer Part No.: 48099-5701
MP200-MP204 = Spacer M3 SMD
  MP200-MP202: Manufacturer Part No.: 9774030360R
  MP203 MP204: Manufacturer Part No.: 9774080360R
R200 = R-560R-63mW-5%-0402: Resistor 560 ohm 63mW 5% 0603; Rating: 63mW; Tolerance: 5%; Value: 560R
TP200 TP201 = TP-Keystone-5011: Testpin Eye TH; Manufacturere Name: Keystone; Manufacturer Part No.: 5011
X1 = CON-JAE-MM70-314-310B1-314-0.5mm: as X1 on sheet Ethernet

## Sheet Power_Switch.SchDoc
size A3; PageSetup: Record=PageOptions|CenterHorizontal=True|CenterVertical=True|PrintScale=0.71|XCorrection=1.00|YCorrection=1.00|PrintKind=0|BorderSize=5000000|LeftOffset=0|BottomOffset=0|Orientation=2|PaperLength=1000|PaperWidth=1000|Scale=100|PaperSource=7|PrintQuality=-4|MediaType=1|DitherType=10|PaperKind=A4|PrintScaleMode=1; Date: 27.05.2014; DrawnBy: luths8; Organization: BFH; Address1: Bern University of Applied Sciences; Address2: Engineering and Information Technology; Address3: Jlcoweg 1; Address4: CH-3400 Burgdorf; DocumentNumber: 3; Revision: 1.1; SheetNumber: 3; SheetTotal: 16; CurrentDate: 27.05.2014
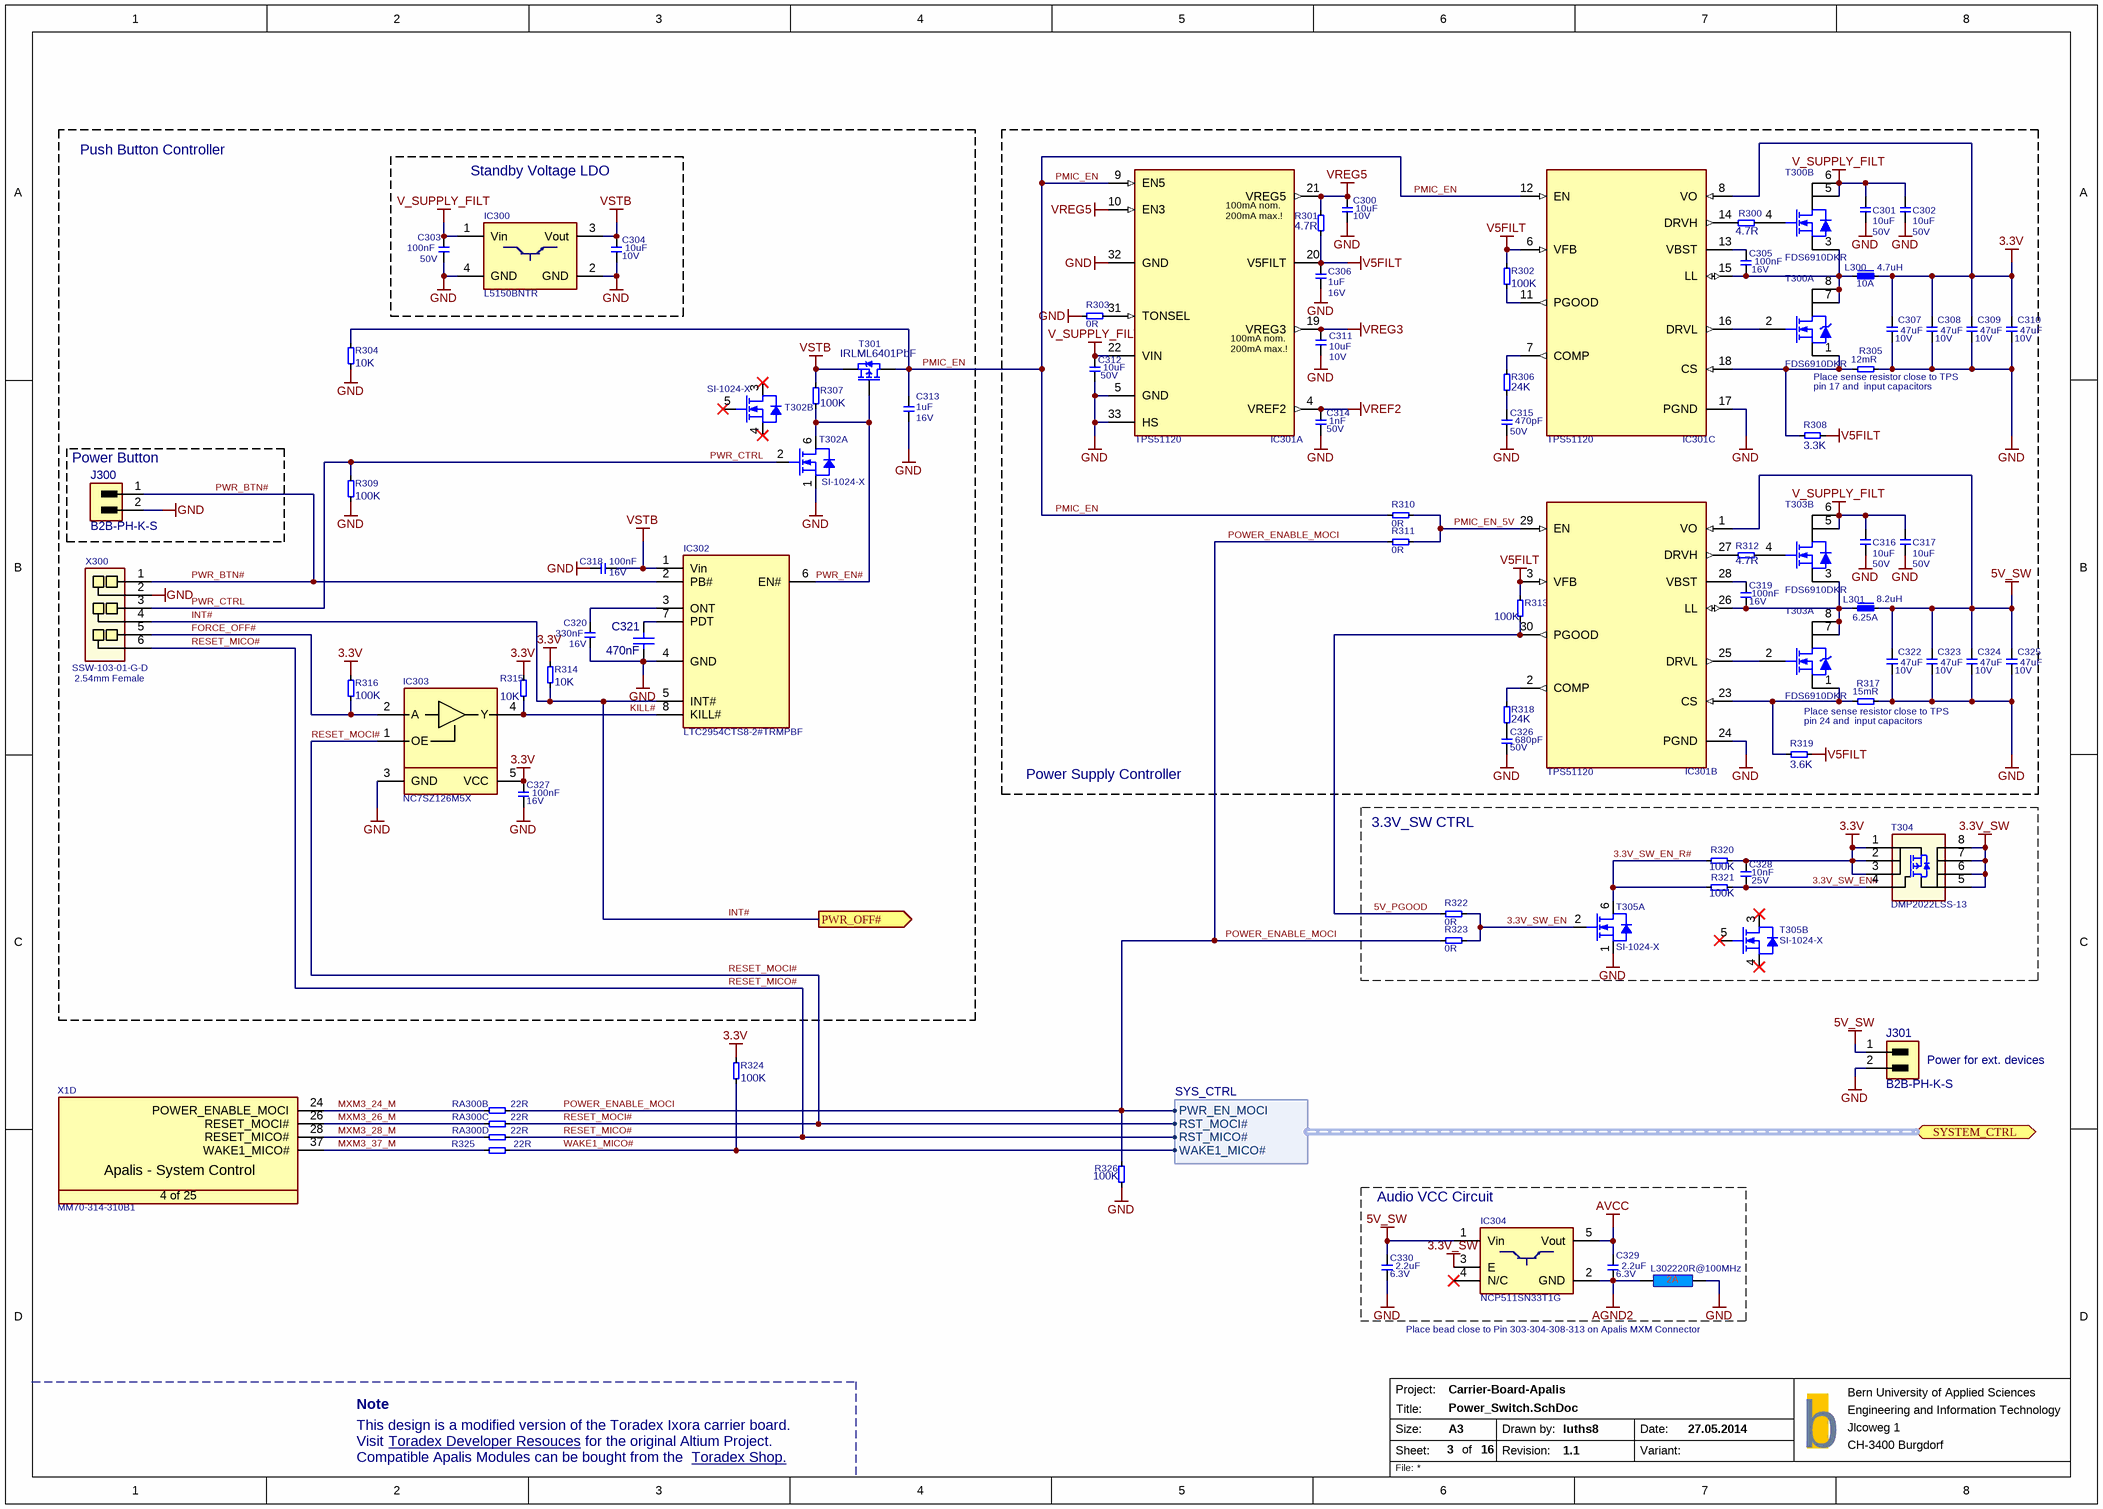
[diagram p4: Power_Switch.SchDoc]

### Parts
C300  Rating: 10V  [SMD0603CAP]  (hidden comment: 10uF)
C301  Rating: 50V  [SMD1210CAP]  (hidden comment: 10uF)
C302  Rating: 50V  [SMD1210CAP]  (hidden comment: 10uF)
C303  Rating: 50V  [SMD0603CAP]  (hidden comment: 100nF)
C304  Rating: 10V  [SMD0603CAP]  (hidden comment: 10uF)
C305  Rating: 16V  [SMD0603CAP]  (hidden comment: 100nF)
C306  Rating: 16V  [SMD0603CAP]  (hidden comment: 1uF)
C307  Rating: 10V  [SMD0805CAP]  (hidden comment: 47uF)
C308  Rating: 10V  [SMD0805CAP]  (hidden comment: 47uF)
C309  Rating: 10V  [SMD0805CAP]  (hidden comment: 47uF)
C310  Rating: 10V  [SMD0805CAP]  (hidden comment: 47uF)
C311  Rating: 10V  [SMD0603CAP]  (hidden comment: 10uF)
C312  Rating: 50V  [SMD1210CAP]  (hidden comment: 10uF)
C313  Rating: 16V  [SMD0603CAP]  (hidden comment: 1uF)
C314  Rating: 50V  [SMD0603CAP]  (hidden comment: 1nF)
C315  Rating: 50V  [SMD0603CAP]  (hidden comment: 470pF)
C316  Rating: 50V  [SMD1210CAP]  (hidden comment: 10uF)
C317  Rating: 50V  [SMD1210CAP]  (hidden comment: 10uF)
C318  Rating: 16V  [SMD0603CAP]  (hidden comment: 100nF)
C319  Rating: 16V  [SMD0603CAP]  (hidden comment: 100nF)
C320  Rating: 16V  [SMD0805CAP]  (hidden comment: 330nF)
C321  470nF  [SMD0603CAP]
C322  Rating: 10V  [SMD0805CAP]  (hidden comment: 47uF)
C323  Rating: 10V  [SMD0805CAP]  (hidden comment: 47uF)
C324  Rating: 10V  [SMD0805CAP]  (hidden comment: 47uF)
C325  Rating: 10V  [SMD0805CAP]  (hidden comment: 47uF)
C326  Rating: 50V  [SMD0603CAP]  (hidden comment: 680pF)
C327  Rating: 16V  [SMD0603CAP]  (hidden comment: 100nF)
C328  Rating: 25V  [SMD0603CAP]  (hidden comment: 10nF)
C329  Rating: 6.3V  [SMD0603CAP]  (hidden comment: 2.2uF)
C330  Rating: 6.3V  [SMD0603CAP]  (hidden comment: 2.2uF)
IC300  L5150BNTR  [T_ON_NCV4264-2ST50T3G]
IC301  TPS51120  [QFN50P500X500X100-33N]  (parts A,B,C of 3)
IC302  LTC2954CTS8-2#TRMPBF  [T_LINEAR_LTC2954CTS8-2#PBF]
IC303  NC7SZ126M5X  [SOT95P279X142-5N]
IC304  NCP511SN33T1G  [SOT95P279X142-5N]
J300  B2B-PH-K-S  [B2B-PH-K-S]
J301  B2B-PH-K-S  [B2B-PH-K-S]
L300  Rating: 10A  [T_INDM110100]  (hidden comment: 4.7uH)
L301  Rating: 6.25A  [T_INDM120120X80N]  (hidden comment: 8.2uH)
L302  220R@100MHz  [INDC1608X95N]
R300  4.7R  [SMD0603RES]
R301  4.7R  [SMD0603RES]
R302  100K  [SMD0603RES]
R303  0R  [SMD0603RES]
R304  10K  [SMD0603RES]
R305  12mR  [SMD1206RES]
R306  24K  [SMD0603RES]
R307  100K  [SMD0603RES]
R308  3.3K  [SMD0603RES]
R309  100K  [SMD0603RES]
R310  0R  [SMD0603RES]
R311  0R  [SMD0603RES]
R312  4.7R  [SMD0603RES]
R313  100K  [SMD0603RES]
R314  10K  [SMD0603RES]
R315  10K  [SMD0603RES]
R316  100K  [SMD0603RES]
R317  15mR  [SMD1206RES]
R318  24K  [SMD0603RES]
R319  3.6K  [SMD0603RES]
R320  100K  [SMD0603RES]
R321  100K  [SMD0603RES]
R322  0R  [SMD0603RES]
R323  0R  [SMD0603RES]
R324  100K  [SMD0603RES]
R325  22R  [SMD0603RES]
R326  100K  [SMD0603RES]
RA300  22R  [T_Resistor_Array_X4]  (parts B,C,D of 4)
T300  FDS6910DKR  [SOIC127P600X173-8N]  (parts A,B of 2)
T301  IRLML6401PbF  [SOT95P237X112-3N]
T302  Manufacturer Part No.: SI-1024-X  [SOTFL50P160X60-6N]  (hidden comment: T-Vishay-SI-1024X-N)  (parts A,B of 2)
T303  FDS6910DKR  [SOIC127P600X173-8N]  (parts A,B of 2)
T304  DMP2022LSS-13  [SOIC127P600X173-8N]
T305  Manufacturer Part No.: SI-1024-X  [SOTFL50P160X60-6N]  (hidden comment: T-Vishay-SI-1024X-N)  (parts A,B of 2)
X1  Manufacturer Part No.: MM70-314-310B1  [T_JAE_MM70-314-310B1]  (hidden comment: CON-JAE-MM70-314-310B1-314-0.5mm)  (part D of 25)
X300  Manufacturer Part No.: SSW-103-01-G-D  [T_Samtec_SSW-103-01-G-D]  (hidden comment: TSW-103-01-G-D)

### Blocks framed on the sheet
Push Button Controller: C313 C318 C320 C321 C327 IC302 IC303 R304 R307 R309 R314-R316 T301 T302 X300
Standby Voltage LDO: C303 C304 IC300
Power Supply Controller: C300-C302 C305-C312 C314-C317 C319 C322-C326 IC301 L300 L301 R300-R303 R305 R306 R308 R310-R313 R317-R319 T300 T303
Power Button: J300
3.3V_SW CTRL: C328 R320-R323 T304 T305
Audio VCC Circuit: C329 C330 IC304 L302

### Ports
PWR_OFF# (out), SYSTEM_CTRL (bidir, harness SYS_CTRL, see 12, 18, 19)

### Harnesses
SYS_CTRL: PWR_EN_MOCI, RST_MOCI#, RST_MICO#, WAKE1_MICO#

### Nets
3.3V: C307.2 C308.2 C309.2 C310.2 C327.1 C328.2 IC301.8(VO) IC303.5(VCC) L300.2 R314.1 R315.1 R316.2 R320.1 R324.2 T304.1(S) T304.2(S) T304.3(S)
3.3V_SW: IC304.3(E) T304.5(D) T304.6(D) T304.7(D) T304.8(D)
5V_SW: C322.2 C323.2 C324.2 C325.2 C330.2 IC301.1(VO) IC304.1(Vin) J301.1 L301.2
AGND2: C329.1 IC304.2(GND) L302.1
AVCC: C329.2 IC304.5(Vout)
GND: C300.1 C301.1 C302.1 C303.1 C304.1 C306.1 C307.1 C308.1 C309.1 C310.1 C311.1 C312.1 C313.1 C314.1 C315.1 C316.1 C317.1 C318.1 C320.1 C321.2(q) C322.1 C323.1 C324.1 C325.1 C326.1 C327.2 C330.1 IC300.2(GND) IC300.4(GND) IC301.5(GND) IC301.17(PGND) IC301.24(PGND) IC301.32(GND) IC301.33(HS) IC302.4(GND) IC303.3(GND) J300.2 J301.2 L302.2 R303.1 R304.1 R305.2 R309.1 R317.2 R326.1 T302.1(S) T305.1(S) X300.2
V5FILT: C306.2 IC301.3(VFB) IC301.6(VFB) IC301.20(V5FILT) R301.1 R302.2 R308.2 R313.2 R319.2
V_SUPPLY_FILT: C301.2 C302.2 C303.2 C312.2 C316.2 C317.2 IC300.1(Vin) IC301.22(VIN) T300.5(D) T300.6(D) T303.5(D) T303.6(D)
VREF2: C314.2 IC301.4(VREF2)
VREG3: C311.2 IC301.19(VREG3)
VREG5: C300.2 IC301.10(EN3) IC301.21(VREG5) R301.2
VSTB: C304.2 C318.2 IC300.3(Vout) IC302.1(Vin) R307.2 T301.2
3.3V_SW_EN: R322.1 R323.2 T305.2(G)
3.3V_SW_EN#: C328.1 R321.1 T304.4(G)
3.3V_SW_EN_R#: R320.2 R321.2 T305.6(D)
5V_PGOOD: IC301.30(PGOOD) R313.1 R322.2
FORCE_OFF#: IC303.2(A) R316.1 X300.5
INT#: IC302.5(INT#) R314.2 X300.4 ; port PWR_OFF#
KILL#: IC302.8(KILL#) IC303.4(Y) R315.2
MXM3_24_M: RA300.2 X1.24(POWER_ENABLE_MOCI)
MXM3_26_M: RA300.3 X1.26(RESET_MOCI#)
MXM3_28_M: RA300.4 X1.28(RESET_MICO#)
MXM3_37_M: R325.1 X1.37(WAKE1_MICO#)
PMIC_EN: C313.2 IC301.9(EN5) IC301.12(EN) R304.2 R310.1 T301.3
PMIC_EN_5V: IC301.29(EN) R310.2 R311.2
POWER_ENABLE_MOCI: R311.1 R323.1 R326.2 RA300.6 ; port SYSTEM_CTRL.PWR_EN_MOCI
PWR_BTN#: IC302.2(PB#) J300.1 X300.1
PWR_CTRL: R309.2 T302.2(G) X300.3
PWR_EN#: IC302.6(EN#) R307.1 T301.1 T302.6(D)
RESET_MICO#: RA300.8 X300.6 ; port SYSTEM_CTRL.RST_MICO#
RESET_MOCI#: IC303.1(OE) RA300.7 ; port SYSTEM_CTRL.RST_MOCI#
WAKE1_MICO#: R324.1 R325.2 ; port SYSTEM_CTRL.WAKE1_MICO#
NetC305_1: C305.1 IC301.15(LL) L300.1 T300.3(S) T300.7(D) T300.8(D)
NetC305_2: C305.2 IC301.13(VBST)
NetC315_2: C315.2 R306.1
NetC319_1: C319.1 IC301.26(LL) L301.1 T303.3(S) T303.7(D) T303.8(D)
NetC319_2: C319.2 IC301.28(VBST)
NetC320_2: C320.2 IC302.3(ONT)
NetC321_1: C321.1 IC302.7(PDT)
NetC326_2: C326.2 R318.1
NetIC301_2: IC301.2(COMP) R318.2
NetIC301_7: IC301.7(COMP) R306.2
NetIC301_11: IC301.11(PGOOD) R302.1
NetIC301_14: IC301.14(DRVH) R300.1
NetIC301_16: IC301.16(DRVL) T300.2(G)
NetIC301_18: IC301.18(CS) R305.1 R308.1 T300.1(S)
NetIC301_23: IC301.23(CS) R317.1 R319.1 T303.1(S)
NetIC301_25: IC301.25(DRVL) T303.2(G)
NetIC301_27: IC301.27(DRVH) R312.1
NetIC301_31: IC301.31(TONSEL) R303.2
NetR300_2: R300.2 T300.4(G)
NetR312_2: R312.2 T303.4(G)

Not connected (* = marked no-connect by the designer): IC304 4(N/C)*; T302 3(D)* 4(S)* 5(G)*; T305 3(D)* 4(S)* 5(G)*

### Notes on the sheet
- (near R305) Place sense resistor close to TPS
- (near R305) pin 17 and  input capacitors
- (near X300) 2.54mm Female
- (near R317) Place sense resistor close to TPS
- pin 24 and  input capacitors
- (near J301) Power for ext. devices
- Place bead close to Pin 303-304-308-313 on Apalis MXM Connector
- Note
- This design is a modified version of the Toradex Ixora carrier board.
- Visit
- Compatible Apalis Modules can be bought from the
- Toradex Developer Resouces <https://developer.toradex.com/products/ixora-carrier-board>
- for the original Altium Project.
- Toradex Shop. <https://www.toradex.com/order-now/apalis-arm-family>
- Project:
- Size:
- Sheet:
- Title:
- A3
- of
- Drawn by:
- Revision:
- Date:
- Variant:
- b
- File:
- (in symbol CON-JAE-MM70-314-310B1-314-0.5mm, part D) Apalis - System Control; 4 of 25
- (in symbol IC-TI-TPS51120, part A) 100mA nom.; 200mA max.!

### Library data of the parts
C300 C304 C311 = C-X5R-10uF-10V-20%-0603: Capacitor Ceramic X5R 10uF 10V 20% 0603; Tolerance: 20%; Type: X5R; Value: 10uF
C301 C302 C312 C316 C317 = C-X5R-10uF-50V-20%-1210: Capacitor Ceramic X5R 10uF 50V 20% 1210; Tolerance: 20%; Type: X5R; Value: 10uF
C303 = C-X7R-100nF-50V-20%-0603: Capacitor Ceramic X7R 100nF 50V 20% 0603; Tolerance: 20%; Type: X7R; Value: 100nF
C305 C318 C319 C327 = C-X7R-100nF-16V-10%-0402: Capacitor Ceramic X7R 100nF 16V 10% 0603; Tolerance: 10%; Type: X7R; Value: 100nF
C306 C313 = C-X5R-1uF-16V-20%-0603: Capacitor Ceramic X5R 1uF 16V 20% 0603; Tolerance: 20%; Type: X5R; Value: 1uF
C307-C310 C322-C325 = C-X5R-47uF-10V-20%-0805: Capacitor Ceramic X5R 47uF 10V 20% 0805; Tolerance: 20%; Type: X5R; Value: 47uF
C314 = C-X7R-1nF-50V-10%-0402: Capacitor Ceramic X7R 1nF 50V 10% 0603; Tolerance: 10%; Type: X7R; Value: 1nF
C315 = C-X7R-470pF-50V-10%-0402: Capacitor Ceramic X7R 470pF 50V 10% 0603; Tolerance: 10%; Type: X7R; Value: 470pF
C320 = C-X7R-330nF-16V-10%-0805: Capacitor Ceramic X7R 330nF 16V 10% 0805; Tolerance: 10%; Type: X7R; Value: 330nF
C321 = Capacitor Ceramic: Ceramic Capacitor; Voltage: *
C326 = C-X7R-680pF-50V-10%-0402: Capacitor Ceramic X7R 680pF 50V 10% 0603; Tolerance: 10%; Type: X7R; Value: 680pF
C328 = C-X7R-10nF-25V-10%-0402: Capacitor Ceramic X7R 10nF 25V 10% 0603; Tolerance: 10%; Type: X7R; Value: 10nF
C329 C330 = C-X5R-2.2uF-6.3V-20%-0603: Capacitor Ceramic X5R 2.2uF 6.3V 20% 0603; Tolerance: 20%; Type: X5R; Value: 2.2uF
IC300 = IC-ON-NCV4264-2ST50T3G: L5150BNTR LDO Regulator; Manufacturer Name: STMicroelectronics; Manufacturer Part No.: L5150BNTR
IC301 = IC-TI-TPS51120: Power Supply Controller; Manufacturer Name: Texas Instruments; Manufacturer Part No.: TPS51120
IC302 = IC-LIN-LTC2954CTS8-2#PBF: Push Button On/Off Controller; Manufacturer Name: Linear; Manufacturer Part No.: LTC2954CTS8-2#TRMPBF
IC303 = IC-FAR-NC7SZ126M5X: NC7SZ126M5X  Buffer Three-State Output; Manufacturer Name: Fairchild Semiconductor; Manufacturer Part No.: NC7SZ126M5X
IC304 = IC-ON-NCP511SN33T1G: NCP511SN33T1G LDO Regulator; Manufacturer Name: ON Semiconductor; Manufacturer Part No.: NCP511SN33T1G
J300 J301 = Connector 2x1P: Manufacturer Part No.: B2B-PH-K-S
L300 = L-Bourns-SRP1038A-4R7M: Inductor 4.7uH 10A 20% 15.5 mOhm -40°C to125°C; Manufacturer Name: Bourns; Tolerance: 20%; Manufacturer Part No.: SRP1038A-4R7M; Value: 4.7uH; DC Resistance: 15.5 mOhm
L301 = L-Wurth-744771008-8.2uH-6.25A-20%: Inductance 8.2uH 6.25A 20%; Manufacturer Name: Wurth; Tolerance: 20%; Manufacturer Part No.: 744771008; Value: 8.2uH
L302 = L-220R@100MHz-2A-25%-0603: as L700 on sheet Ethernet; Rating: 2A; Value: 220R@100MHz
R300 R301 R312 = R-4.7R-63mW-5%-0402: Resistor 4.7 ohm 63mW 5% 0603; Rating: 63mW; Tolerance: 5%; Value: 4.7R
R302 R307 R309 R313 R316 R320 R321 R324 R326 = R-100KR-63mW-5%-0402: Resistor 100 Kohm 63mW 5% 0603; Value: 100KR; Rating: 63mW; Tolerance: 5%
R303 = R-0R-63mW-1%-0402: Resistor 0 ohm 63mW 1% 0603; Rating: 63mW; Tolerance: 1%; Value: 0R
R304 R314 R315 = R-10KR-63mW-5%-0402: Resistor 10 Kohm 63mW 5% 0603; Value: 10KR; Rating: 63mW; Tolerance: 5%
R305 = R-12mR-250mW-1%-1206: Resistor 12 mohm 250mW 1% 1206; Rating: 250mW; Tolerance: 1%; Value: 12mR
R306 R318 = R-24KR-63mW-1%-0402: Resistor 24 Kohm 63mW 1% 0603; Value: 24KR; Rating: 63mW; Tolerance: 1%
R308 = R-3.3KR-63mW-1%-0402: Resistor 3.3 Kohm 63mW 1% 0603; Value: 3.3KR; Rating: 63mW; Tolerance: 1%
R310 R311 R322 R323 = R-0R-63mW-1%-0603: Resistor 0 ohm 63mW 1% 0603; Rating: 63mW; Tolerance: 1%; Value: 0R
R317 = R-15mR-250mW-1%-1206: Resistor 15 mohm 250mW 1% 1206; Rating: 250mW; Tolerance: 1%; Value: 15mR
R319 = R-3.6KR-63mW-1%-0402: Resistor 3.6 Kohm 63mW 1% 0603; Value: 3.6KR; Rating: 63mW; Tolerance: 1%
R325 = R-22R-63mW-5%-0402: Resistor 22 ohm 63mW 5% 0603; Rating: 63mW; Tolerance: 5%; Value: 22R
RA300 = RA-22R-63mW-5%-1206-div: Resistor Array 22 R 63mW 5% 1206; Tolerance: 5%; Power Dissipation: 63mW; Value: 22R
T300 T303 = T-Fairchild-FDS6982AS-N: N-Channel PowerTrench SyncFET; Manufacturer Name: Fairchild; Manufacturer Part No.: FDS6910DKR
T301 = T-IR-IRLML6401PbF-SOT-23: p-channel MOSFET, IRLML6401PbF; Manufacturer Name: International Rectifier; Manufacturer Part No.: IRLML6401PbF
T302 T305 = T-Vishay-SI-1024X-N: Dual N-Channel 20V (D-S)  MOSFET; Manufacturer Name: Vishay
T304 = T-Diodes-DMP2022LSS-13-8-SOIC: p-channel MOSFET, DMP2022LSS-13; Manufacturer Name: DIODES; Manufacturer Part No.: DMP2022LSS-13
X1 = CON-JAE-MM70-314-310B1-314-0.5mm: as X1 on sheet Ethernet
X300 = CON-Samtec-SSW-103-01-G-D: Receptacle Female Socket, 2x3 Pins, 2.54mm pitch; Manufacturer Name: Samtec; No. of ways: 2x3; Pitch: 2.54mm

## Sheet RGB_Display.SchDoc
size A3; PageSetup: Record=PageOptions|CenterHorizontal=True|CenterVertical=True|PrintScale=0.73|XCorrection=1.00|YCorrection=1.00|PrintKind=0|BorderSize=5000000|LeftOffset=0|BottomOffset=0|Orientation=2|PaperLength=1000|PaperWidth=1000|Scale=100|PaperSource=7|PrintQuality=-4|MediaType=1|DitherType=10|PaperKind=A4|PrintScaleMode=1; Date: 27.05.2014; DrawnBy: luths8; Organization: BFH; Address1: Bern University of Applied Sciences; Address2: Engineering and Information Technology; Address3: Jlcoweg 1; Address4: CH-3400 Burgdorf; DocumentNumber: 9; Revision: 1.0; SheetNumber: 9; SheetTotal: 16; CurrentDate: 27.05.2014
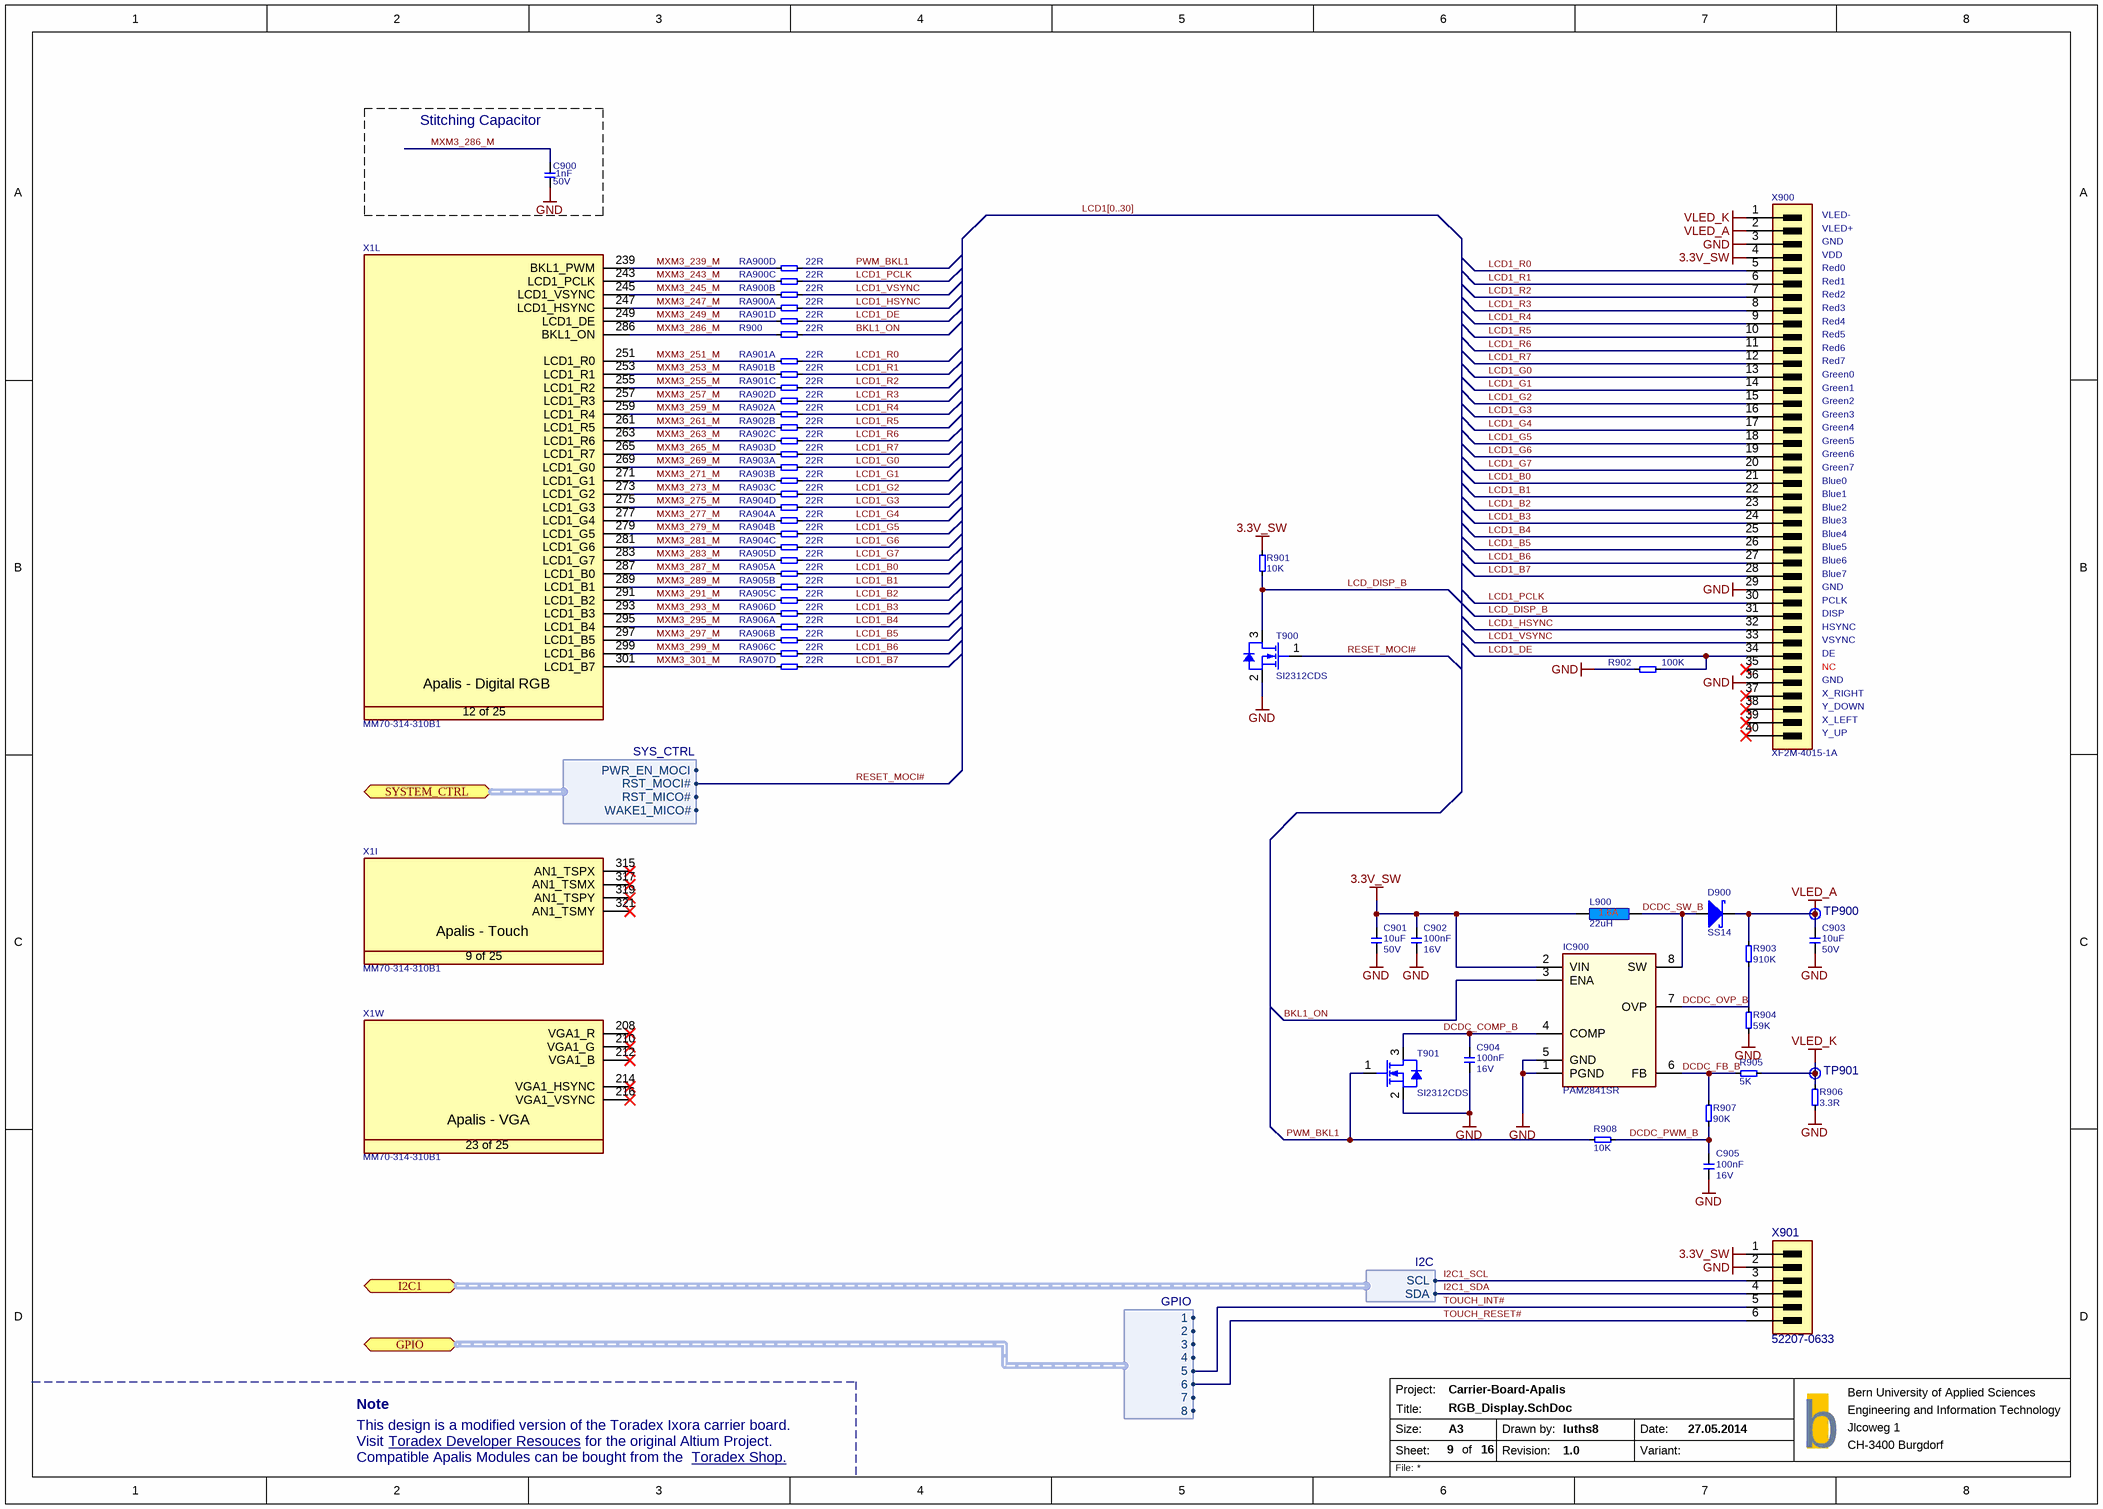
[diagram p5: RGB_Display.SchDoc]

### Parts
C900  Rating: 50V  [SMD0603CAP]  (hidden comment: 1nF)
C901  Rating: 50V  [SMD1210CAP]  (hidden comment: 10uF)
C902  Rating: 16V  [SMD0603CAP]  (hidden comment: 100nF)
C903  Rating: 50V  [SMD1210CAP]  (hidden comment: 10uF)
C904  value 100nF  Rating: 16V  [SMD0603CAP]  (hidden comment: 100nF 16V)
C905  value 100nF  Rating: 16V  [SMD0603CAP]  (hidden comment: 100nF 16V)
D900  SS14  [T_DO-214-AC]
IC900  PAM2841SR  [T_TSOP65P490X110-8N]
L900  22uH  [T_INDM5050]
R900  22R  [SMD0603RES]
R901  10K  [SMD0603RES]
R902  100K  [SMD0603RES]
R903  910K  [SMD0603RES]
R904  59K  [SMD0603RES]
R905  5K  [SMD0603RES]
R906  3.3R  [SMD0603RES]
R907  90K  [SMD0603RES]
R908  10K  [SMD0603RES]
RA900  22R  [T_Resistor_Array_X4]  (parts A,B,C,D of 4)
RA901  22R  [T_Resistor_Array_X4]  (parts A,B,C,D of 4)
RA902  22R  [T_Resistor_Array_X4]  (parts A,B,C,D of 4)
RA903  22R  [T_Resistor_Array_X4]  (parts A,B,C,D of 4)
RA904  22R  [T_Resistor_Array_X4]  (parts A,B,C,D of 4)
RA905  22R  [T_Resistor_Array_X4]  (parts A,B,C,D of 4)
RA906  22R  [T_Resistor_Array_X4]  (parts A,B,C,D of 4)
RA907  22R  [T_Resistor_Array_X4]  (part D of 4)
T900  SI2312CDS  [T_SOT95P230X110-3N]
T901  SI2312CDS  [T_SOT95P230X110-3N]
TP900  Testpoint  [TP]  (value not drawn)  (no BOM)
TP901  Testpoint  [TP]  (value not drawn)  (no BOM)
X1  Manufacturer Part No.: MM70-314-310B1  [T_JAE_MM70-314-310B1]  (hidden comment: CON-JAE-MM70-314-310B1-314-0.5mm)  (parts I,L,W of 25)
X900  XF2M-4015-1A  [T_Omron_XF2M-4015-1A-MIRROR]
X901  52207-0633  [T_MOLEX_52207-0633]

### Blocks framed on the sheet
Stitching Capacitor: C900

### Ports
GPIO (bidir, harness GPIO, see 11, 19, 4), I2C1 (bidir, harness I2C, see 17, 18, 19, 5), SYSTEM_CTRL (bidir, harness SYS_CTRL, see 18, 19, 4)

### Harnesses
I2C: SCL, SDA
SYS_CTRL: PWR_EN_MOCI, RST_MOCI#, RST_MICO#, WAKE1_MICO#
GPIO: 1, 2, 3, 4, 5, 6, 7, 8

### Nets
3.3V_SW: C901.2 C902.1 IC900.2(VIN) L900.1 R901.2 X900.4(VCC) X901.1
GND: C900.1 C901.1 C902.2 C903.1 C904.1 C905.1 IC900.1(PGND) IC900.5(GND) R902.1 R904.1 R906.1 T900.2(S) T901.2(S) X900.3(VCC) X900.29(VSS) X900.36(VDD) X901.2
VLED_A: C903.2 D900.1 R903.2 TP900.1 X900.2(VSS)
VLED_K: R905.2 R906.2 TP901.1 X900.1(VSS)
BKL1_ON: IC900.3(ENA) R900.2
DCDC_COMP_B: C904.2 IC900.4(COMP) T901.3(D)
DCDC_FB_B: IC900.6(FB) R905.1 R907.2
DCDC_OVP_B: IC900.7(OVP) R903.1 R904.2
DCDC_PWM_B: C905.2 R907.1 R908.2
DCDC_SW_B: D900.2 IC900.8(SW) L900.2
I2C1_SCL: X901.3 ; port I2C1.SCL
I2C1_SDA: X901.4 ; port I2C1.SDA
LCD1_B0: RA905.7 X900.21(VSS)
LCD1_B1: RA905.6 X900.22(R5)
LCD1_B2: RA905.5 X900.23(R4)
LCD1_B3: RA906.8 X900.24(R3)
LCD1_B4: RA906.7 X900.25(R2)
LCD1_B5: RA906.6 X900.26(R1)
LCD1_B6: RA906.5 X900.27(R0)
LCD1_B7: RA907.8 X900.28(DCLK)
LCD1_DE: R902.2 RA901.8 X900.34(SHUT)
LCD1_G0: RA903.7 X900.13(B0)
LCD1_G1: RA903.6 X900.14(VSS)
LCD1_G2: RA903.5 X900.15(G5)
LCD1_G3: RA904.8 X900.16(G4)
LCD1_G4: RA904.7 X900.17(G3)
LCD1_G5: RA904.6 X900.18(G2)
LCD1_G6: RA904.5 X900.19(G1)
LCD1_G7: RA905.8 X900.20(G0)
LCD1_HSYNC: RA900.5 X900.32(ENB)
LCD1_PCLK: RA900.7 X900.30(HSYNC)
LCD1_R0: RA901.7 X900.5(PWCTRL)
LCD1_R1: RA901.6 X900.6(LEDCTRL)
LCD1_R2: RA901.5 X900.7(RESET#)
LCD1_R3: RA902.8 X900.8(B5)
LCD1_R4: RA902.7 X900.9(B4)
LCD1_R5: RA902.6 X900.10(B3)
LCD1_R6: RA902.5 X900.11(B2)
LCD1_R7: RA903.8 X900.12(B1)
LCD1_VSYNC: RA900.6 X900.33(NC)
LCD_DISP_B: R901.1 T900.3(D) X900.31(VSYNC)
MXM3_239_M: RA900.4 X1.239(BKL1_PWM)
MXM3_243_M: RA900.3 X1.243(LCD1_PCLK)
MXM3_245_M: RA900.2 X1.245(LCD1_VSYNC)
MXM3_247_M: RA900.1 X1.247(LCD1_HSYNC)
MXM3_249_M: RA901.4 X1.249(LCD1_DE)
MXM3_251_M: RA901.3 X1.251(LCD1_R0)
MXM3_253_M: RA901.2 X1.253(LCD1_R1)
MXM3_255_M: RA901.1 X1.255(LCD1_R2)
MXM3_257_M: RA902.4 X1.257(LCD1_R3)
MXM3_259_M: RA902.3 X1.259(LCD1_R4)
MXM3_261_M: RA902.2 X1.261(LCD1_R5)
MXM3_263_M: RA902.1 X1.263(LCD1_R6)
MXM3_265_M: RA903.4 X1.265(LCD1_R7)
MXM3_269_M: RA903.3 X1.269(LCD1_G0)
MXM3_271_M: RA903.2 X1.271(LCD1_G1)
MXM3_273_M: RA903.1 X1.273(LCD1_G2)
MXM3_275_M: RA904.4 X1.275(LCD1_G3)
MXM3_277_M: RA904.3 X1.277(LCD1_G4)
MXM3_279_M: RA904.2 X1.279(LCD1_G5)
MXM3_281_M: RA904.1 X1.281(LCD1_G6)
MXM3_283_M: RA905.4 X1.283(LCD1_G7)
MXM3_286_M: C900.2 R900.1 X1.286(BKL1_ON)
MXM3_287_M: RA905.3 X1.287(LCD1_B0)
MXM3_289_M: RA905.2 X1.289(LCD1_B1)
MXM3_291_M: RA905.1 X1.291(LCD1_B2)
MXM3_293_M: RA906.4 X1.293(LCD1_B3)
MXM3_295_M: RA906.3 X1.295(LCD1_B4)
MXM3_297_M: RA906.2 X1.297(LCD1_B5)
MXM3_299_M: RA906.1 X1.299(LCD1_B6)
MXM3_301_M: RA907.4 X1.301(LCD1_B7)
PWM_BKL1: R908.1 RA900.8 T901.1(G)
RESET_MOCI#: T900.1(G) ; port SYSTEM_CTRL.RST_MOCI#
TOUCH_INT#: X901.5 ; port GPIO.5
TOUCH_RESET#: X901.6 ; port GPIO.6

Not connected (* = marked no-connect by the designer): X1 208(VGA1_R)* 210(VGA1_G)* 212(VGA1_B)* 214(VGA1_HSYNC)* 216(VGA1_VSYNC)* 315(AN1_TSPX)* 317(AN1_TSMX)* 319(AN1_TSPY)* 321(AN1_TSMY)*; X900 35(VSS)* 37(YU)* 38(XR)* 39(YD)* 40(XL)*

### Buses and harness runs
bus LCD1[0..30]

### Notes on the sheet
- (near X900) VLED-
- (near X900) VLED+
- (near X900) GND
- (near X900) Red0
- (near X900) Red1
- (near X900) Red2
- (near X900) Red3
- (near X900) VDD
- (near X900) Green0
- (near X900) Red4
- (near X900) Red5
- (near X900) Red6
- (near X900) Red7
- (near X900) Green1
- (near X900) Green2
- (near X900) Green3
- (near X900) Green4
- (near X900) Green5
- (near X900) Blue0
- (near X900) Blue1
- (near X900) Blue2
- (near X900) Green6
- (near X900) Green7
- (near X900) Blue3
- (near X900) Blue4
- (near X900) Blue5
- (near X900) Blue6
- (near X900) Blue7
- (near X900) PCLK
- (near X900) DISP
- (near X900) HSYNC
- (near X900) VSYNC
- (near X900) DE
- (near X900) NC
- (near X900) X_RIGHT
- (near X900) Y_DOWN
- (near X900) X_LEFT
- (near X900) Y_UP
- Note
- This design is a modified version of the Toradex Ixora carrier board.
- Visit
- Compatible Apalis Modules can be bought from the
- Toradex Developer Resouces <https://developer.toradex.com/products/ixora-carrier-board>
- for the original Altium Project.
- Toradex Shop. <https://www.toradex.com/order-now/apalis-arm-family>
- Project:
- Size:
- Sheet:
- Title:
- A3
- of
- Drawn by:
- Revision:
- Date:
- Variant:
- b
- File:
- (in symbol CON-JAE-MM70-314-310B1-314-0.5mm, part I) Apalis - Touch; 9 of 25
- (in symbol CON-JAE-MM70-314-310B1-314-0.5mm, part L) Apalis - Digital RGB; 12 of 25
- (in symbol CON-JAE-MM70-314-310B1-314-0.5mm, part W) Apalis - VGA; 23 of 25

### Library data of the parts
C900 = C-X7R-1nF-50V-10%-0402: Capacitor Ceramic X7R 1nF 50V 10% 0603; Tolerance: 10%; Type: X7R; Value: 1nF
C901 C903 = C-X5R-10uF-50V-10%-1210: Capacitor Ceramic X5R 10uF 50V 10% 1210; Manufacturer: Generic; Tolerance: 10%; Type: X5R; Manufacturer Part Number: *; Value: 10uF
C902 = C-X7R-100nF-16V-10%-0603: Capacitor Ceramic X7R 100nF 16V 10% 0603; Manufacturer: Generic; Tolerance: 10%; Type: X7R; Manufacturer Part Number: *; Value: 100nF
C904 C905 = C-X7R-100nF-16V-10%-0603: Capacitor Ceramic X7R 100nF 16V 10% 0603; Tolerance: 10%; Type: X7R
D900 = D-Fairchild-SS14: Schottky Diode 40V 1A; Manufacturer Name: Fairdhild; Manufacturer Part No.: SS14
IC900 = IC-DiodesInc-PAM2841GR: Diodes Inc, PAM2841GR, DC/DC step-up LED driver; Manufacturer: Diodes Incorporated; Manufacturer Part No.: PAM2841GR; Package: DFN2x2-8
L900 = L-Bourns-SRN5040-220M: Inductor shielded 22uH 1.6A; Manufacturer: Generic; Tolerance: 25%; Rating: 1.6A; Manufacturer Part Number: *; Value: 22uH
R900 = R-22R-63mW-5%-0402: Resistor 22 ohm 63mW 5% 0603; Rating: 63mW; Tolerance: 5%; Value: 22R
R901 R908 = R-10KR-63mW-1%-0603: Resistor 10 Kohm 63mW 1% 0603; Manufacturer: Generic; Rating: 63mW; Tolerance: 1%; Value: 10K; Manufacturer Part Number: *
R902 = R-100KR-63mW-5%-0603: Resistor 100 Kohm 63mW 5% 0603; Manufacturer: Generic; Value: 100KR; Rating: 63mW; Tolerance: 5%; Manufacturer Part Number: *
R903 = R-910KR-63mW-1%-0603: Resistor 910 Kohm 63mW 1% 0603; Manufacturer: Generic; Value: 910KR; Rating: 63mW; Tolerance: 1%; Manufacturer Part Number: *
R904 = R-59KR-63mW-1%-0603: Resistor 59 Kohm 63mW 1% 0603; Manufacturer: Generic; Value: 49KR; Rating: 63mW; Tolerance: 1%; Manufacturer Part Number: *
R905 = R-5KR-63mW-1%-0603: Resistor 5 Kohm 63mW 1% 0603; Manufacturer: Generic; Rating: 63mW; Tolerance: 1%; Value: 5K; Manufacturer Part Number: *
R906 = R-3.3R-63mW-1%-0603: Resistor 3.3 ohm 63mW 1% 0603; Manufacturer: Generic; Rating: 63mW; Tolerance: 1%; Manufacturer Part Number: *; Value: 3.3R
R907 = R-90KR-63mW-1%-0603: Resistor 90 Kohm 63mW 1% 0603; Manufacturer: Generic; Rating: 63mW; Tolerance: 1%; Value: 90K; Manufacturer Part Number: *
RA900-RA907 = RA-22R-63mW-5%-1206-div: Resistor Array 22 R 63mW 5% 1206; Tolerance: 5%; Power Dissipation: 63mW; Value: 22R
T900 T901 = T-Vishay-SI2312CDS: N-Channel 20V (D-S)  MOSFET; Manufacturer: Vishay; Manufacturer Part No.: SI2312CDS
X1 = CON-JAE-MM70-314-310B1-314-0.5mm: as X1 on sheet Ethernet
X900 = CON-Omron-XF2M-4015-1A-40-0.5mm: RGB Connector; Manufacturer Name: Omron; No. of ways: 40; Pitch: 0.5mm; Manufacturer Part No.: XF2M-4015-1A; System: Connector
X901 = CON-Molex-52207-0633: 1mm Pitch FFC/FPC Connector; Manufacturer Name: Molex; No. of ways: 8; Pitch: 0.5mm; Manufacturer Part No.: 52207-0633; System: Connector

## Sheet RTC.SchDoc
size A3; PageSetup: Record=PageOptions|CenterHorizontal=True|CenterVertical=True|PrintScale=0.73|XCorrection=1.00|YCorrection=1.00|PrintKind=0|BorderSize=5000000|LeftOffset=0|BottomOffset=0|Orientation=2|PaperLength=1000|PaperWidth=1000|Scale=100|PaperSource=7|PrintQuality=-4|MediaType=1|DitherType=10|PaperKind=A4|PrintScaleMode=1; Date: 27.05.2014; DrawnBy: luths8; Organization: BFH; Address1: Bern University of Applied Sciences; Address2: Engineering and Information Technology; Address3: Jlcoweg 1; Address4: CH-3400 Burgdorf; DocumentNumber: 4; Revision: 1.0; SheetNumber: 4; SheetTotal: 16; CurrentDate: 27.05.2014
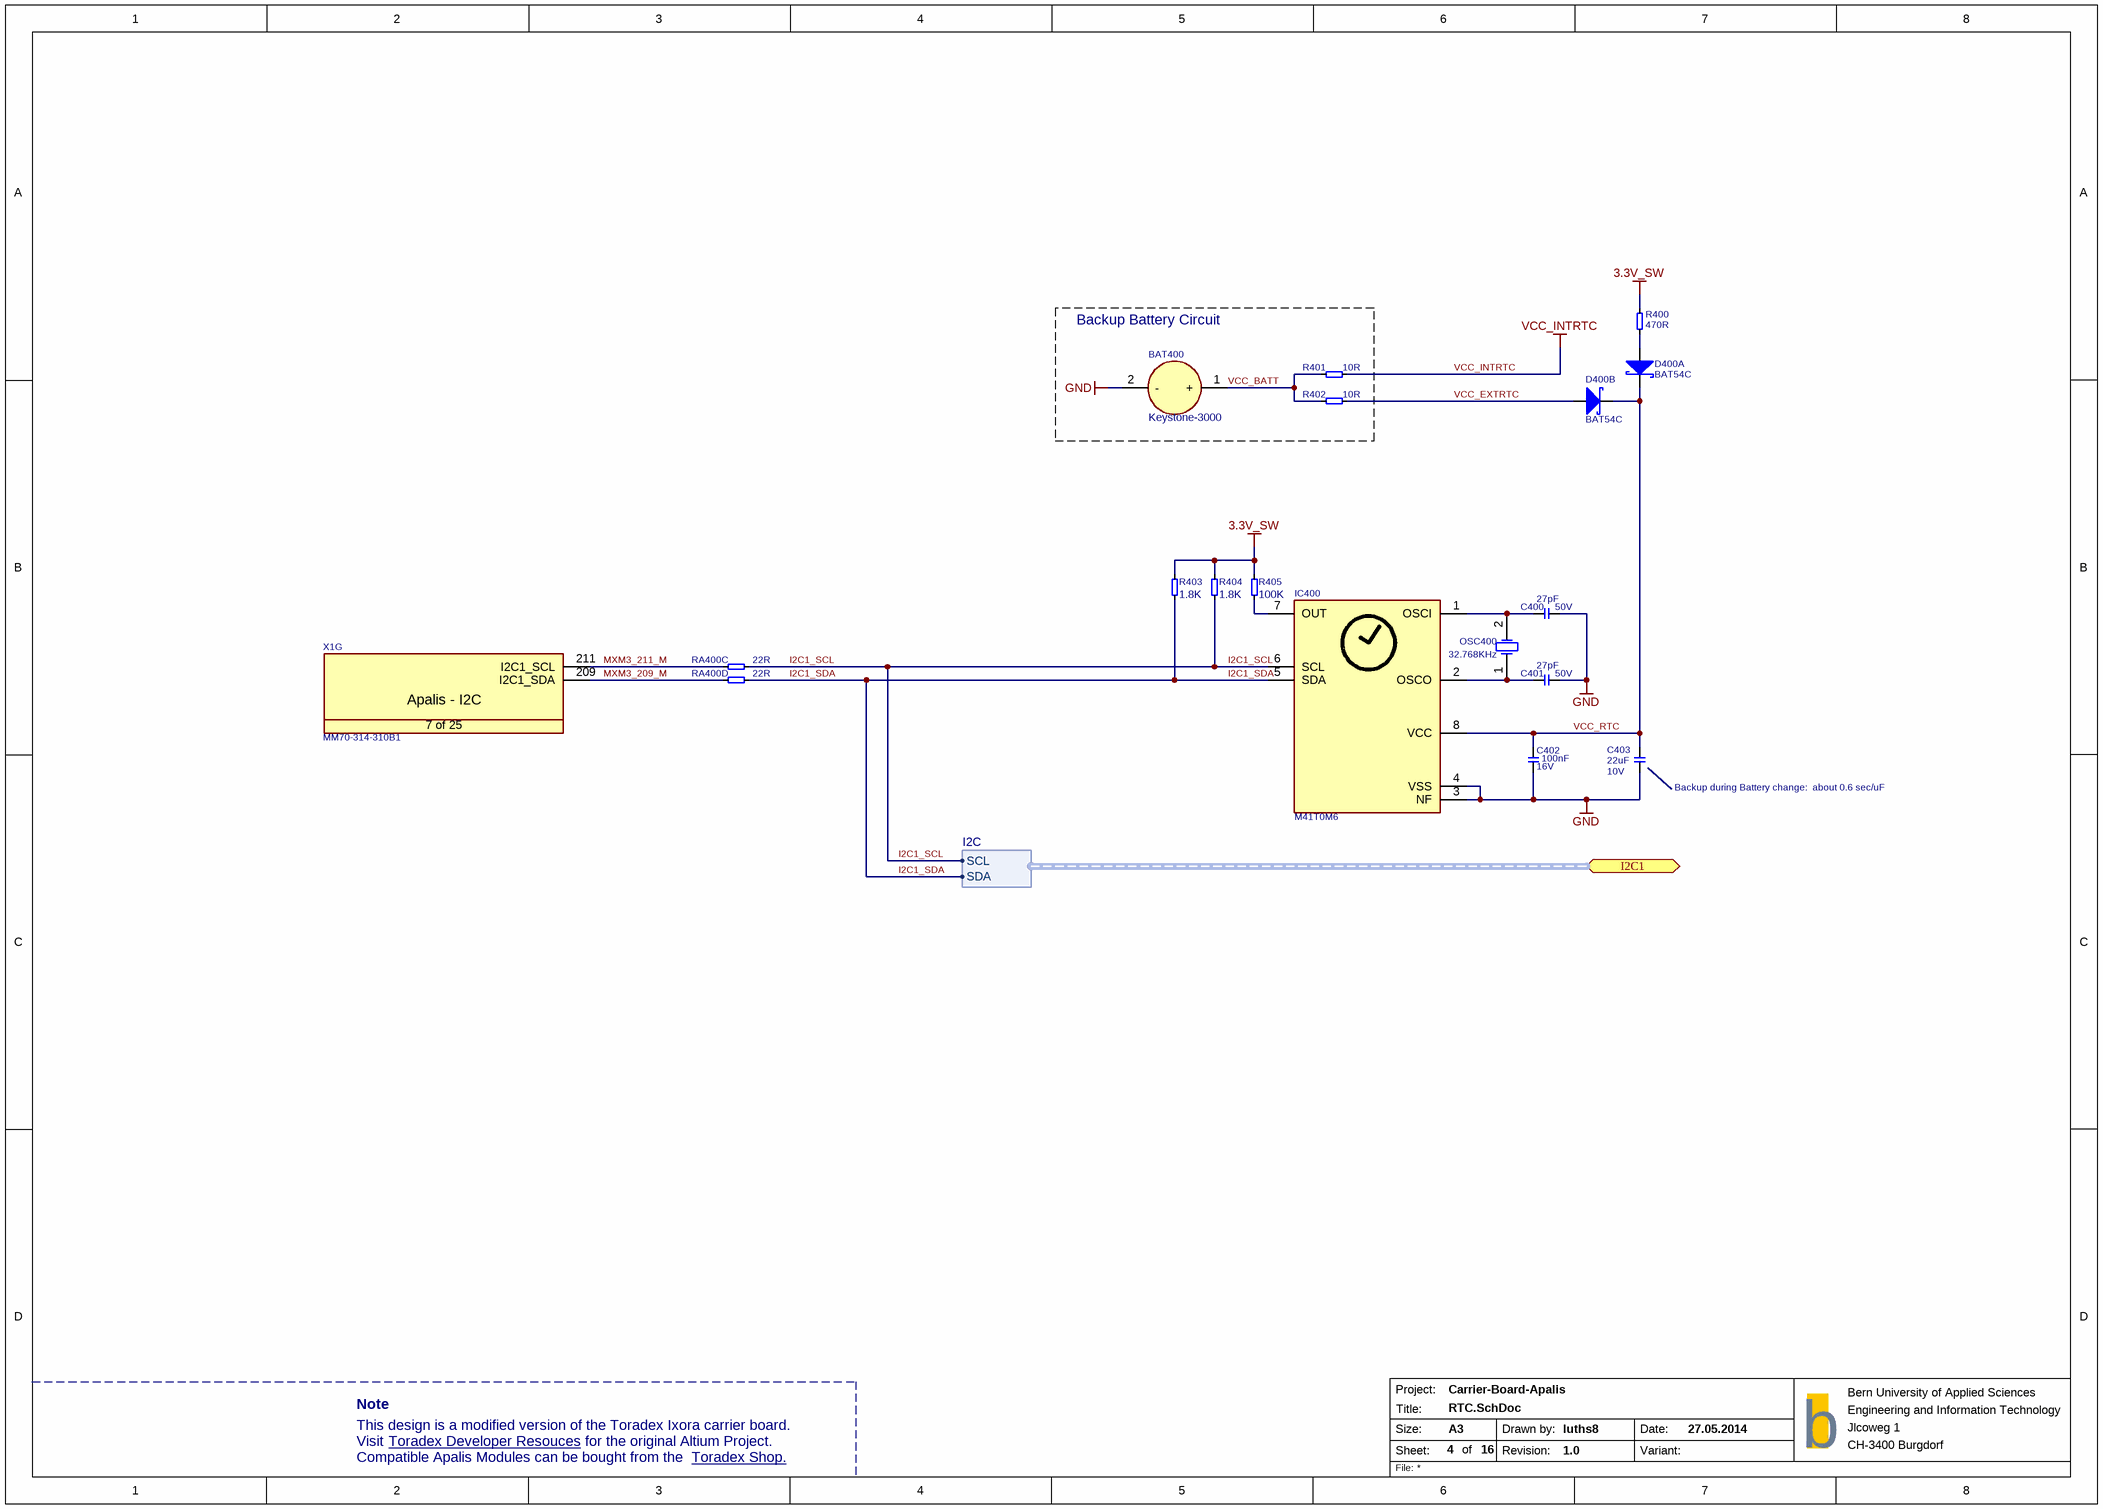
[diagram p6: RTC.SchDoc]

### Parts
BAT400  Keystone-3000  [T_Keystone_3000]
C400  Rating: 50V  [SMD0603CAP]  (hidden comment: 27pF)
C401  Rating: 50V  [SMD0603CAP]  (hidden comment: 27pF)
C402  Rating: 16V  [SMD0603CAP]  (hidden comment: 100nF)
C403  Rating: 10V  [SMD0805CAP]  (hidden comment: 22uF)
D400  BAT54C  [SOT95P230X110-3N]  (parts A,B of 2)
IC400  M41T0M6  [SOIC127P600X173-8N]
OSC400  value 32.768KHz  [T_MC_CC4V-T1A]  (hidden comment: CC4V-T1A)
R400  470R  [SMD0603RES]
R401  10R  [SMD0603RES]
R402  10R  [SMD0603RES]
R403  1.8K  [SMD0603RES]
R404  1.8K  [SMD0603RES]
R405  100K  [SMD0603RES]
RA400  22R  [T_Resistor_Array_X4]  (parts C,D of 4)
X1  Manufacturer Part No.: MM70-314-310B1  [T_JAE_MM70-314-310B1]  (hidden comment: CON-JAE-MM70-314-310B1-314-0.5mm)  (part G of 25)

### Blocks framed on the sheet
Backup Battery Circuit: BAT400 R401 R402

### Ports
I2C1 (bidir, harness I2C, see 12, 17, 18, 19)

### Harnesses
I2C: SCL, SDA

### Nets
3.3V_SW: R400.2 R403.2 R404.2 R405.2
GND: BAT400.2(-) C400.2 C401.2 C402.1 C403.2 IC400.3(NF) IC400.4(VSS)
VCC_INTRTC: R401.2
I2C1_SCL: IC400.6(SCL) R404.1 RA400.7 ; port I2C1.SCL
I2C1_SDA: IC400.5(SDA) R403.1 RA400.8 ; port I2C1.SDA
MXM3_209_M: RA400.4 X1.209(I2C1_SDA)
MXM3_211_M: RA400.3 X1.211(I2C1_SCL)
VCC_BATT: BAT400.1(+) R401.1 R402.1
VCC_EXTRTC: D400.2 R402.2
VCC_RTC: C402.2 C403.1 D400.3 IC400.8(VCC)
NetC400_1: C400.1 IC400.1(OSCI) OSC400.2(OSC2)
NetC401_1: C401.1 IC400.2(OSCO) OSC400.1(OSC1)
NetD400_1: D400.1 R400.1
NetIC400_7: IC400.7(OUT) R405.1

### Notes on the sheet
- (near C403) Backup during Battery change:  about 0.6 sec/uF
- Note
- This design is a modified version of the Toradex Ixora carrier board.
- Visit
- Compatible Apalis Modules can be bought from the
- Toradex Developer Resouces <https://developer.toradex.com/products/ixora-carrier-board>
- for the original Altium Project.
- Toradex Shop. <https://www.toradex.com/order-now/apalis-arm-family>
- Project:
- Size:
- Sheet:
- Title:
- A3
- of
- Drawn by:
- Revision:
- Date:
- Variant:
- b
- File:
- (in symbol CON-JAE-MM70-314-310B1-314-0.5mm, part G) Apalis - I2C; 7 of 25

### Library data of the parts
BAT400 = BAT-Keystone-3000: Battery Holder; Manufacturer Part No.: 3000; Manufacturer Name: Keystone
C400 C401 = C-NPO-27pF-50V-5%-0603: Capacitor Ceramic NPO 27pF 50V 5% 0603; Tolerance: 5%; Type: NPO; Value: 27pF
C402 = C-X7R-100nF-16V-10%-0402: Capacitor Ceramic X7R 100nF 16V 10% 0603; Tolerance: 10%; Type: X7R; Value: 100nF
C403 = C-X5R-22uF-10V-20%-0805: Capacitor Ceramic X5R 22uF 10V 20% 0805; Tolerance: 20%; Type: X5R; Value: 22uF
D400 = D-Philips-BAT54C-Schottky-30V-200mA: BAT54 Schottky Diode; Manufacturer: Philips; Manufacturer Part No.: BAT54C
IC400 = IC-ST-M41T0M6: RTC M41T0M6; Manufacturer Name: ST; Manufacturer Part No.: M41T0M6
OSC400 = OSC-MC-CC4V-T1A-32.768KHz-30ppm-5x1.9mm: Quartz 32.768kHz; Manufacturer Name: Micro Crystal; Tolerance: 30ppm; Manufacturer Part No.: CC4V-T1A
R400 = R-470R-63mW-5%-0402: Resistor 470 ohm 63mW 5% 0603; Rating: 63mW; Tolerance: 5%; Value: 470R
R401 R402 = R-10R-63mW-5%-0603: Resistor 10 ohm 63mW 5% 0603; Rating: 63mW; Tolerance: 5%; Value: 10R
R403 R404 = R-1.8KR-63mW-5%-0402: Resistor 1.8 Kohm 63mW 5% 0603; Value: 1.8KR; Rating: 63mW; Tolerance: 5%
R405 = R-100KR-63mW-5%-0402: as R302 on sheet Power_Switch; Rating: 63mW; Tolerance: 5%
RA400 = RA-22R-63mW-5%-1206-div: Resistor Array 22 R 63mW 5% 1206; Tolerance: 5%; Power Dissipation: 63mW; Value: 22R
X1 = CON-JAE-MM70-314-310B1-314-0.5mm: as X1 on sheet Ethernet